# Altium project bdcmc-26.PrjPcb (part 1 of 2)
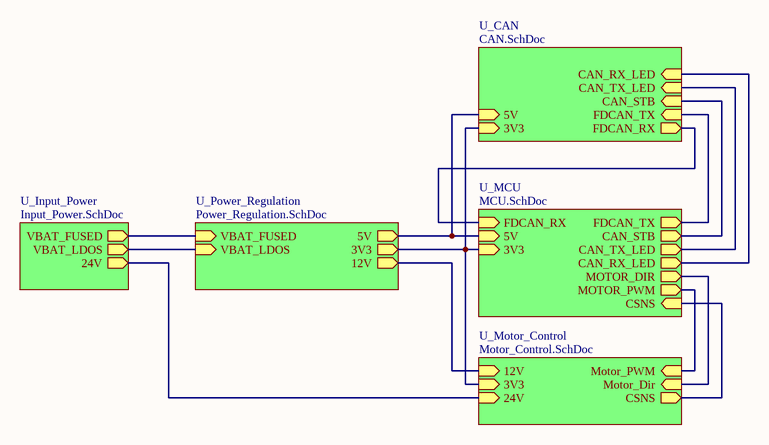
[diagram p0: TLD.SchDoc]
6 sheets, 206 parts. Net scope: hierarchical (ports join the sheet entries above them; power ports are global).
Board file: bdcmc.PcbDoc
Sheets:
  TLD.SchDoc
    U_CAN = CAN.SchDoc
    U_Input_Power = Input_Power.SchDoc
    U_MCU = MCU.SchDoc
    U_Motor_Control = Motor_Control.SchDoc
    U_Power_Regulation = Power_Regulation.SchDoc

## Sheet TLD.SchDoc
size A; SheetNumber: 1; SheetTotal: 6

### Sub-sheets
U_CAN = CAN.SchDoc: FDCAN_RX (out), FDCAN_TX (in), CAN_TX_LED (in), CAN_RX_LED (in), CAN_STB (in), 5V (in), 3V3 (in)
U_Input_Power = Input_Power.SchDoc: VBAT_FUSED (out), VBAT_LDOS (out), 24V (out)
U_MCU = MCU.SchDoc: MOTOR_PWM (out), MOTOR_DIR (out), CAN_TX_LED (out), CAN_RX_LED (out), FDCAN_TX (out), FDCAN_RX (in), 5V (in), 3V3 (in), CAN_STB (out), CSNS (in)
U_Motor_Control = Motor_Control.SchDoc: Motor_PWM (in), Motor_Dir (in), 12V (in), 3V3 (in), CSNS (out), 24V (in)
U_Power_Regulation = Power_Regulation.SchDoc: 5V (out), 3V3 (out), 12V (out), VBAT_FUSED (in), VBAT_LDOS (in)

### Nets
3V3: sheet U_CAN/3V3, sheet U_MCU/3V3, sheet U_Motor_Control/3V3, sheet U_Power_Regulation/3V3
5V: sheet U_CAN/5V, sheet U_MCU/5V, sheet U_Power_Regulation/5V
12V: sheet U_Motor_Control/12V, sheet U_Power_Regulation/12V
24V: sheet U_Input_Power/24V, sheet U_Motor_Control/24V
VBAT_FUSED: sheet U_Input_Power/VBAT_FUSED, sheet U_Power_Regulation/VBAT_FUSED
VBAT_LDOS: sheet U_Input_Power/VBAT_LDOS, sheet U_Power_Regulation/VBAT_LDOS
CAN_RX_LED: sheet U_CAN/CAN_RX_LED, sheet U_MCU/CAN_RX_LED
CAN_STB: sheet U_CAN/CAN_STB, sheet U_MCU/CAN_STB
CAN_TX_LED: sheet U_CAN/CAN_TX_LED, sheet U_MCU/CAN_TX_LED
CSNS: sheet U_MCU/CSNS, sheet U_Motor_Control/CSNS
FDCAN_RX: sheet U_CAN/FDCAN_RX, sheet U_MCU/FDCAN_RX
FDCAN_TX: sheet U_CAN/FDCAN_TX, sheet U_MCU/FDCAN_TX
MOTOR_DIR: sheet U_MCU/MOTOR_DIR, sheet U_Motor_Control/Motor_Dir
MOTOR_PWM: sheet U_MCU/MOTOR_PWM, sheet U_Motor_Control/Motor_PWM

## Sheet CAN.SchDoc
size A; SheetNumber: 2; SheetTotal: 6
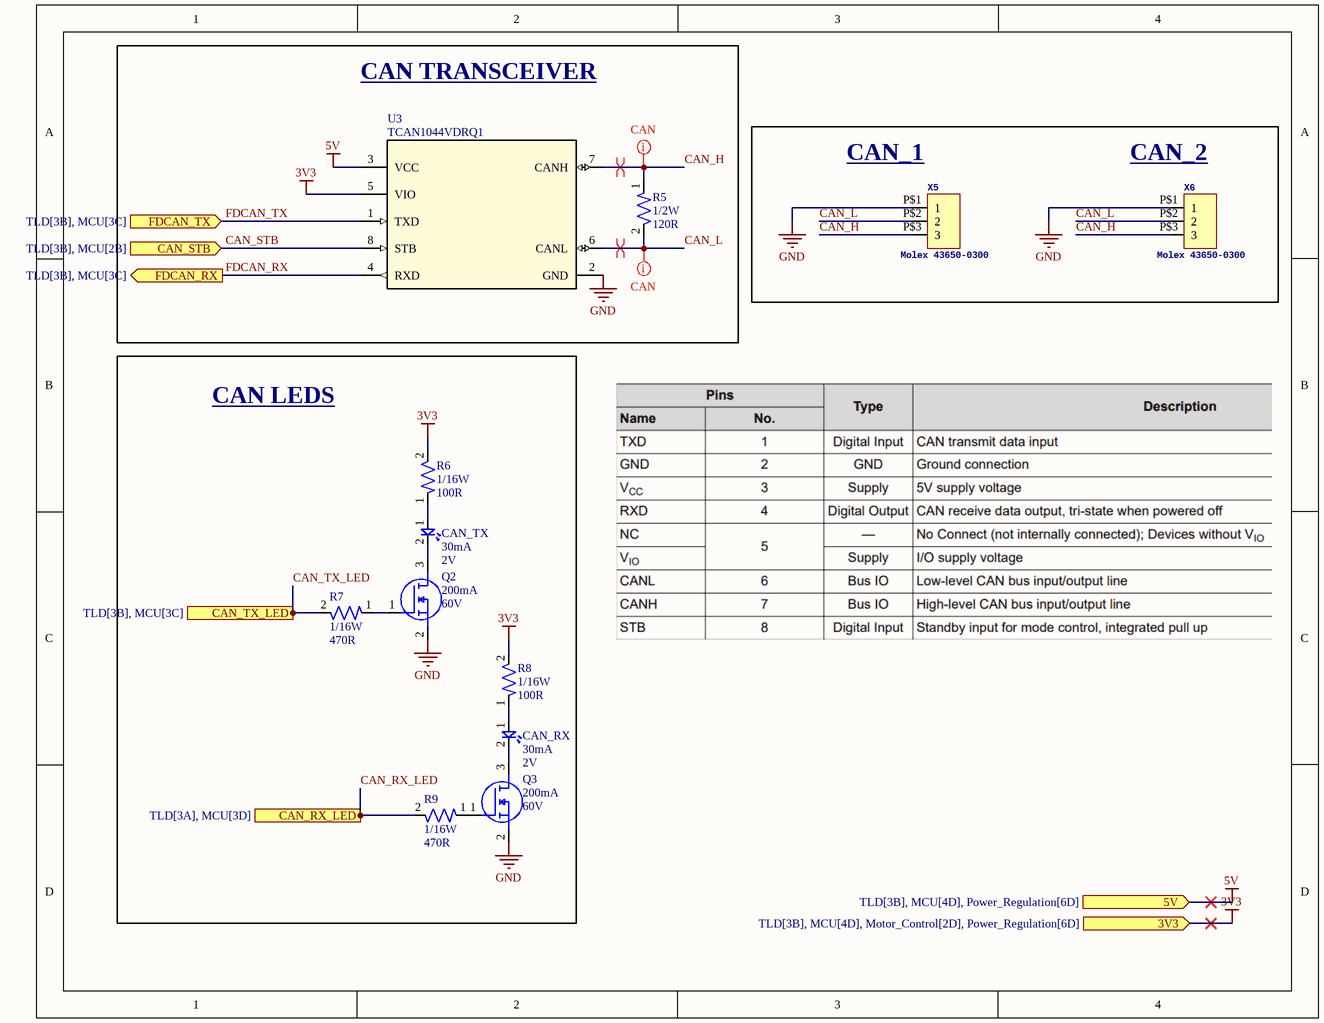
[diagram p1: CAN.SchDoc]

### Parts
CAN_RX  Forward Current: 30mA  Forward Voltage: 2V  [LED-0603]  (hidden comment: BL-HKC36G-AV-TRB)
CAN_TX  Forward Current: 30mA  Forward Voltage: 2V  [LED-0603]  (hidden comment: BL-HKC36G-AV-TRB)
Q2  Continuous Current: 200mA  Voltage: 60V  [IC-SOT23-3]  (hidden comment: T2N7002AK,LM)
Q3  Continuous Current: 200mA  Voltage: 60V  [IC-SOT23-3]  (hidden comment: T2N7002AK,LM)
R5  Power: 1/2W  Resistance: 120R  [RES-1210]  (hidden comment: RC1210FR-07120RL)
R6  Power: 1/16W  Resistance: 100R  [RES-0402]  (hidden comment: RC0402FR-07100RL)
R7  Power: 1/16W  Resistance: 470R  [RES-0402]  (hidden comment: RC0402FR-07470RL)
R8  Power: 1/16W  Resistance: 100R  [RES-0402]  (hidden comment: RC0402FR-07100RL)
R9  Power: 1/16W  Resistance: 470R  [RES-0402]  (hidden comment: RC0402FR-07470RL)
U3  TCAN1044VDRQ1  [IC-8SOIC]
X5  Molex 43650-0300  [43650-0300]
X6  Molex 43650-0300  [43650-0300]

### Blocks framed on the sheet
CAN TRANSCEIVER: R5 U3
CAN LEDS: CAN_RX CAN_TX Q2 Q3 R6-R9

### Ports
3V3 (in, see TLD[3B], MCU[4D], Motor_Control[2D], Power_Regulation[6D]), 5V (in, see TLD[3B], MCU[4D], Power_Regulation[6D]), CAN_RX_LED (in, see TLD[3A], MCU[3D]), CAN_STB (in, see TLD[3B], MCU[2B]), CAN_TX_LED (in, see TLD[3B], MCU[3C]), FDCAN_RX (out, see TLD[3B], MCU[3C]), FDCAN_TX (in, see TLD[3B], MCU[3C])

### Nets
3V3: R6.2 R8.2 U3.5(VIO) ; port 3V3
5V: U3.3(VCC) ; port 5V
GND: Q2.2(S) Q3.2(S) U3.2(GND) X5.P$1(1) X6.P$1(1)
CAN_H: R5.1 U3.7(CANH) X5.P$3(3) X6.P$3(3)
CAN_L: R5.2 U3.6(CANL) X5.P$2(2) X6.P$2(2)
CAN_RX_LED: R9.2 ; port CAN_RX_LED
CAN_STB: U3.8(STB) ; port CAN_STB
CAN_TX_LED: R7.2 ; port CAN_TX_LED
FDCAN_RX: U3.4(RXD) ; port FDCAN_RX
FDCAN_TX: U3.1(TXD) ; port FDCAN_TX
NetCAN_RX_1: CAN_RX.1 R8.1
NetCAN_RX_2: CAN_RX.2 Q3.3(D)
NetCAN_TX_1: CAN_TX.1 R6.1
NetCAN_TX_2: CAN_TX.2 Q2.3(D)
NetQ2_1: Q2.1(G) R7.1
NetQ3_1: Q3.1(G) R9.1

### Layout directives
differential pair; differential pair class CAN: CAN_H, CAN_L
mark named CAN: CAN_H, CAN_L

### Notes on the sheet
- (near X5) CAN_1
- (near X6) CAN_2

### Library data of the parts
CAN_RX CAN_TX = LED-0001: LED YELLOW CLEAR 0603 SMD; ComponentLink1Description: Datasheet; ComponentLink1URL: https://www.americanbrightled.com/pdffiles/led-components/smt/BL-HKC36G-AV-TRB.pdf
Q2 Q3 = NMOS-200MA-0001: MOSFET N-CH 60V 200MA SOT23; ComponentLink1Description: Datasheet; ComponentLink1URL: https://toshiba.semicon-storage.com/info/T2N7002AK_datasheet_en_20150401.pdf?did=29712&prodName=T2N7002AK
R5 = RES-120-0001: RES 120 OHM 1% 1/2W 1210; Tolerance: 1%; Size: 1210; ComponentLink1Description: Datasheet; ComponentLink1URL: https://www.yageo.com/upload/media/product/products/datasheet/rchip/PYu-RC_Group_51_RoHS_L_12.pdf
R6 R8 = RES-100-0001: RES 100 OHM 1% 1/16W 0402; Tolerance: 1%; Size: 0402; ComponentLink1Description: Datasheet; ComponentLink1URL: https://www.yageo.com/upload/media/product/products/datasheet/rchip/PYu-RC_Group_51_RoHS_L_12.pdf
R7 R9 = RES-470-0001: RES 470 OHM 1% 1/16W 0402; Tolerance: 1%; Size: 0402; ComponentLink1Description: Datasheet; ComponentLink1URL: https://www.yageo.com/upload/media/product/products/datasheet/rchip/PYu-RC_Group_51_RoHS_L_12.pdf
U3 = IC-CAN-0001: IC TRANSCEIVER 1/1 8SOIC; ComponentLink1Description: Datasheet; ComponentLink1URL: https://www.ti.com/lit/ds/symlink/tcan1044-q1.pdf?HQS=dis-dk-null-digikeymode-dsf-pf-null-wwe&ts=1728758303289&ref_url=https%253A%252F%252Fwww.ti.com%252Fgeneral%252Fdocs%252Fsuppproductinfo.tsp%253FdistId%253D10%2526gotoUrl%253Dhttps%253A%252F%252Fwww.ti.com%252Flit%252Fgpn%252Ftcan1044-q1
X5 X6 = Micro-Fit Molex 3 Pin Right Angle: GateName_1: G$1; SymbolName_1: HEADER_POS3; DeviceSetName: HEADER_POS3_?; DeviceName: 43650-0300; LibraryName: con-molex-micro-fit-3_0_2; Package: 43650-0300

## Sheet Input_Power.SchDoc
size A; SheetNumber: 5; SheetTotal: 6
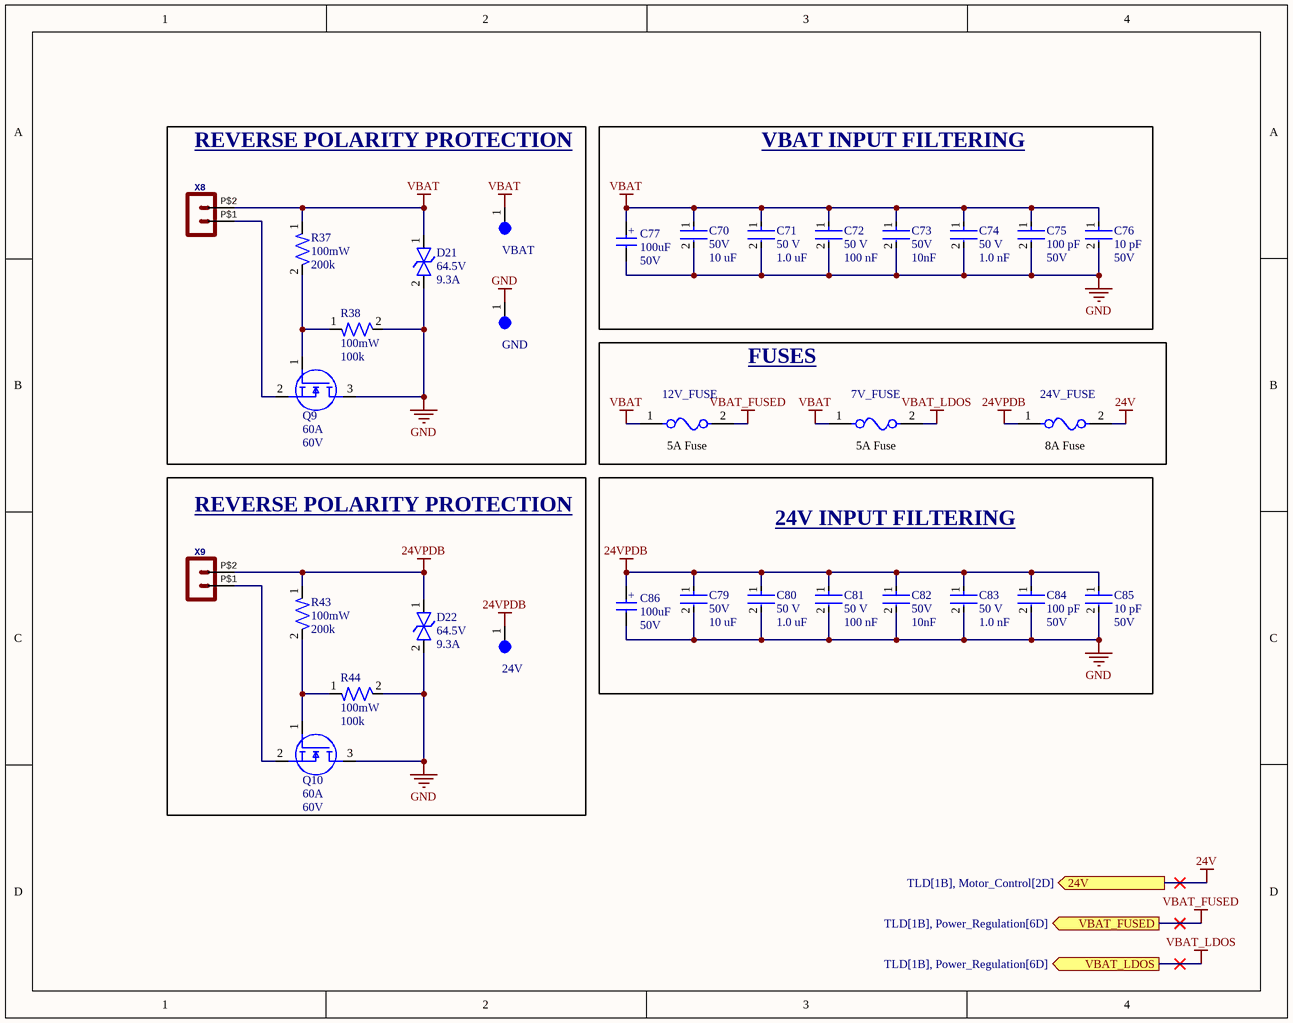
[diagram p2: Input_Power.SchDoc]

### Parts
7V_FUSE  01550900M  [FUSE-0001]  (value not drawn)
12V_FUSE  01550900M  [FUSE-0001]  (value not drawn)
24V  5003  [TEST-POINT-0001]  (value not drawn)
24V_FUSE  01550900M  [FUSE-0001]  (value not drawn)
C70  Voltage: 50V  Capacitance: 10 uF  [CAP-1210]  (hidden comment: CL32B106KBJNNNE)
C71  Voltage: 50 V  Capacitance: 1.0 uF  [CAP-0805]  (hidden comment: CC0805KKX7R9BB105)
C72  Voltage Rating: 50 V  Capacitance: 100 nF  [CAP-0805]  (hidden comment: CC0805KRX7R9BB104)
C73  Voltage: 50V  Capacitance: 10nF  [CAP-0805]  (hidden comment: GRM2195C1H103JA01D)
C74  Voltage: 50 V  Capacitance: 1.0 nF  [CAP-0402]  (hidden comment: CC0402KRX7R9BB102)
C75  Capacitance: 100 pF  Voltage: 50V  [CAP-0402]  (hidden comment: CC0402JRNPO9BN101)
C76  Capacitance: 10 pF  Voltage: 50V  [CAP-0402]  (hidden comment: CC0402JRNPO9BN100)
C77  Capacitance: 100uF  Voltage: 50V  [WCAP-ATUL_8X11.5(DXL)]  (hidden comment: 860040674004)
C79  Voltage: 50V  Capacitance: 10 uF  [CAP-1210]  (hidden comment: CL32B106KBJNNNE)
C80  Voltage: 50 V  Capacitance: 1.0 uF  [CAP-0805]  (hidden comment: CC0805KKX7R9BB105)
C81  Voltage Rating: 50 V  Capacitance: 100 nF  [CAP-0805]  (hidden comment: CC0805KRX7R9BB104)
C82  Voltage: 50V  Capacitance: 10nF  [CAP-0805]  (hidden comment: GRM2195C1H103JA01D)
C83  Voltage: 50 V  Capacitance: 1.0 nF  [CAP-0402]  (hidden comment: CC0402KRX7R9BB102)
C84  Capacitance: 100 pF  Voltage: 50V  [CAP-0402]  (hidden comment: CC0402JRNPO9BN101)
C85  Capacitance: 10 pF  Voltage: 50V  [CAP-0402]  (hidden comment: CC0402JRNPO9BN100)
C86  Capacitance: 100uF  Voltage: 50V  [WCAP-ATUL_8X11.5(DXL)]  (hidden comment: 860040674004)
D21  Voltage Rating: 64.5V  Current Rating: 9.3A  [DO-214AA (SMBJ)]  (hidden comment: SMBJ40CA)
D22  Voltage Rating: 64.5V  Current Rating: 9.3A  [DO-214AA (SMBJ)]  (hidden comment: SMBJ40CA)
GND  5003  [TEST-POINT-0001]  (value not drawn)
Q9  Voltage: 60V  Continuous Current: 60A  [IC-8VSONCLIP]  (hidden comment: CSD18543Q3AT)
Q10  Voltage: 60V  Continuous Current: 60A  [IC-8VSONCLIP]  (hidden comment: CSD18543Q3AT)
R37  Power: 100mW  Resistance: 200k  [RES-0603]  (hidden comment: RC0603FR-07200KL)
R38  Power: 100mW  Resistance: 100k  [RES-0603]  (hidden comment: RC0603FR-07100KL)
R43  Power: 100mW  Resistance: 200k  [RES-0603]  (hidden comment: RC0603FR-07200KL)
R44  Power: 100mW  Resistance: 100k  [RES-0603]  (hidden comment: RC0603FR-07100KL)
VBAT  5003  [TEST-POINT-0001]  (value not drawn)
X8  Molex - Micro-Fit 3.0 Series connector,  3.00mm (0.118") pitch header, 2 positions.  [43045-0200]  (value not drawn)
X9  Molex - Micro-Fit 3.0 Series connector,  3.00mm (0.118") pitch header, 2 positions.  [43045-0200]  (value not drawn)

### Blocks framed on the sheet
REVERSE POLARITY PROTECTION: D21 GND Q9 R37 R38 VBAT X8
VBAT INPUT FILTERING: C70-C77
FUSES: 7V_FUSE 12V_FUSE 24V_FUSE
REVERSE POLARITY PROTECTION: 24V D22 Q10 R43 R44 X9
24V INPUT FILTERING: C79-C86

### Ports
24V (out, see TLD[1B], Motor_Control[2D]), VBAT_FUSED (out, see TLD[1B], Power_Regulation[6D]), VBAT_LDOS (out, see TLD[1B], Power_Regulation[6D])

### Nets
24V: 24V_FUSE.2 ; port 24V
24VPDB: 24V.1 24V_FUSE.1 C79.1 C80.1 C81.1 C82.1 C83.1 C84.1 C85.1 C86.1(POS) D22.1 R43.1 X9.P$2
GND: C70.2 C71.2 C72.2 C73.2 C74.2 C75.2 C76.2 C77.2(NEG) C79.2 C80.2 C81.2 C82.2 C83.2 C84.2 C85.2 C86.2(NEG) D21.2 D22.2 GND.1 Q9.3(D) Q10.3(D) R38.2 R44.2
VBAT: 7V_FUSE.1 12V_FUSE.1 C70.1 C71.1 C72.1 C73.1 C74.1 C75.1 C76.1 C77.1(POS) D21.1 R37.1 VBAT.1 X8.P$2
VBAT_FUSED: 12V_FUSE.2 ; port VBAT_FUSED
VBAT_LDOS: 7V_FUSE.2 ; port VBAT_LDOS
NetQ9_1: Q9.1(G) R37.2 R38.1
NetQ9_2: Q9.2(S) X8.P$1
NetQ10_1: Q10.1(G) R43.2 R44.1
NetQ10_2: Q10.2(S) X9.P$1

### Notes on the sheet
- (near 12V_FUSE) 5A Fuse
- (near 7V_FUSE) 5A Fuse
- (near 24V_FUSE) 8A Fuse
- (in symbol CAP-100u-0001) +

### Library data of the parts
7V_FUSE 12V_FUSE 24V_FUSE = FUSE-0001: FUSE BLOK CARTRIDGE 125V 10A SMD; Fuse Current: 8A; ComponentLink2Description: Datasheet; ComponentLink2URL: https://www.littelfuse.com/~/media/electronics/datasheets/fuses/littelfuse_fuse_154_154t_154l_154tl_datasheet.pdf.pdf; Voltage Rating: 125V
24V GND VBAT = TEST-POINT-0001: Oranange PC Test Point, Miniature Phoisphor Bronze Silver Plating Through Hole Mounting Type
C70 C79 = CAP-10U-0002: CAP CER 10UF 50V X7R 1210; Device Class: Ceramic; Size: 1210; ComponentLink1Description: Datasheet; ComponentLink1URL: https://mm.digikey.com/Volume0/opasdata/d220001/medias/docus/41/CL32B106KBJNNNE_Spec.pdf
C71 C80 = CAP-1U-0001: CAP CER 1UF 50V X7R 0805; ComponentLink2URL: https://www.yageo.com/upload/media/product/productsearch/datasheet/mlcc/UPY-GPHC_X7R_6.3V-to-250V_24.pdf; ComponentLink2Description: Datasheet; Device Class: Ceramic; Size: 0805
C72 C81 = CAP-0.1U-0002: CAP CER 0.1UF 50V X7R 0805; ComponentLink2Description: Datasheet; ComponentLink2URL: https://www.yageo.com/upload/media/product/productsearch/datasheet/mlcc/UPY-GPHC_X7R_6.3V-to-250V_24.pdf; Device Class: Ceramic; Size: 0805
C73 C82 = CAP-10N-0001: CAP CER 10000PF 50V C0G/NP0 0805; Device Class: Ceramic; Size: 0805; ComponentLink1Description: Datasheet; ComponentLink1URL: https://search.murata.co.jp/Ceramy/image/img/A01X/G101/ENG/GRM2195C1H103JA01-01.pdf
C74 C83 = CAP-1N-0001: CAP CER 1000PF 50V X7R 0402; ComponentLink2Description: Datasheet; ComponentLink2URL: http://www.yageo.com/documents/recent/UPY-GP_NP0_16V-to-50V_16.pdf; Device Class: Ceramic; Size: 0402
C75 C84 = CAP-100P-0001: CAP CER 100PF 50V C0G/NPO 0402; Device Class: Ceramic; Size: 0402; ComponentLink1Description: Datasheet; ComponentLink1URL: https://www.yageo.com/upload/media/product/productsearch/datasheet/mlcc/UPY-GP_NP0_16V-to-50V_18.pdf
C76 C85 = CAP-10P-0001: CAP CER 10PF 50V C0G/NPO 0402; Device Class: Ceramic; Size: 0402; ComponentLink1Description: Datasheet; ComponentLink1URL: https://www.yageo.com/upload/media/product/productsearch/datasheet/mlcc/UPY-GP_NP0_16V-to-50V_18.pdf
C77 C86 = CAP-100u-0001: 100 µF 50 V Aluminum Electrolytic Capacitors Radial, Can 7000 Hrs @ 105°C; MF: {'manufacturer': u'W\xfcrth Elektronik'}; Package: None; Price: None; MP: 860040674004; Availability: Unavailable; ComponentLink1Description: Datasheet; ComponentLink1URL: https://www.we-online.com/components/products/datasheet/860040674004.pdf
D21 D22 = DIO-TVS-0001: TVS DIODE 40VWM 64.5VC DO214AA; ComponentLink1Description: Datasheet; ComponentLink1URL: https://www.littelfuse.com/media?resourcetype=datasheets&itemid=09a6ae9a-73cb-4ac4-acac-e6dab92ab953&filename=littelfuse_tvs_diode_smbj_datasheet.pdf
Q9 Q10 = NMOS-60A-0001: MOSFET N-CH 60V 12A/60A 8VSON; ComponentLink2Description: Datasheet; ComponentLink2URL: http://www.ti.com/lit/ds/symlink/csd18543q3a.pdf
R37 R43 = RES-200k-0001: RES SMD 200K OHM 1% 1/10W 0603; Tolerance: 1%; Size: 0603; ComponentLink1Description: Datasheet; ComponentLink1URL: https://www.yageo.com/upload/media/product/products/datasheet/rchip/PYu-RC_Group_51_RoHS_L_12.pdf
R38 R44 = RES-100k-0001: RES SMD 100K OHM 1% 1/10W 0603; Tolerance: 1%; Size: 0603; ComponentLink1Description: Datasheet; ComponentLink1URL: https://www.yageo.com/upload/media/product/products/datasheet/rchip/PYu-RC_Group_51_RoHS_L_12.pdf
X8 X9 = HEADER_POS2_43045-0200: GateName_1: G$1; DeviceSetName: HEADER_POS2_?; SymbolName_1: HEADER_POS2; DeviceName: 43045-0200; LibraryName: con-molex-micro-fit-3_0_2; Package: 43045-0200

## Sheet MCU.SchDoc
size A; SheetNumber: 6; SheetTotal: 6
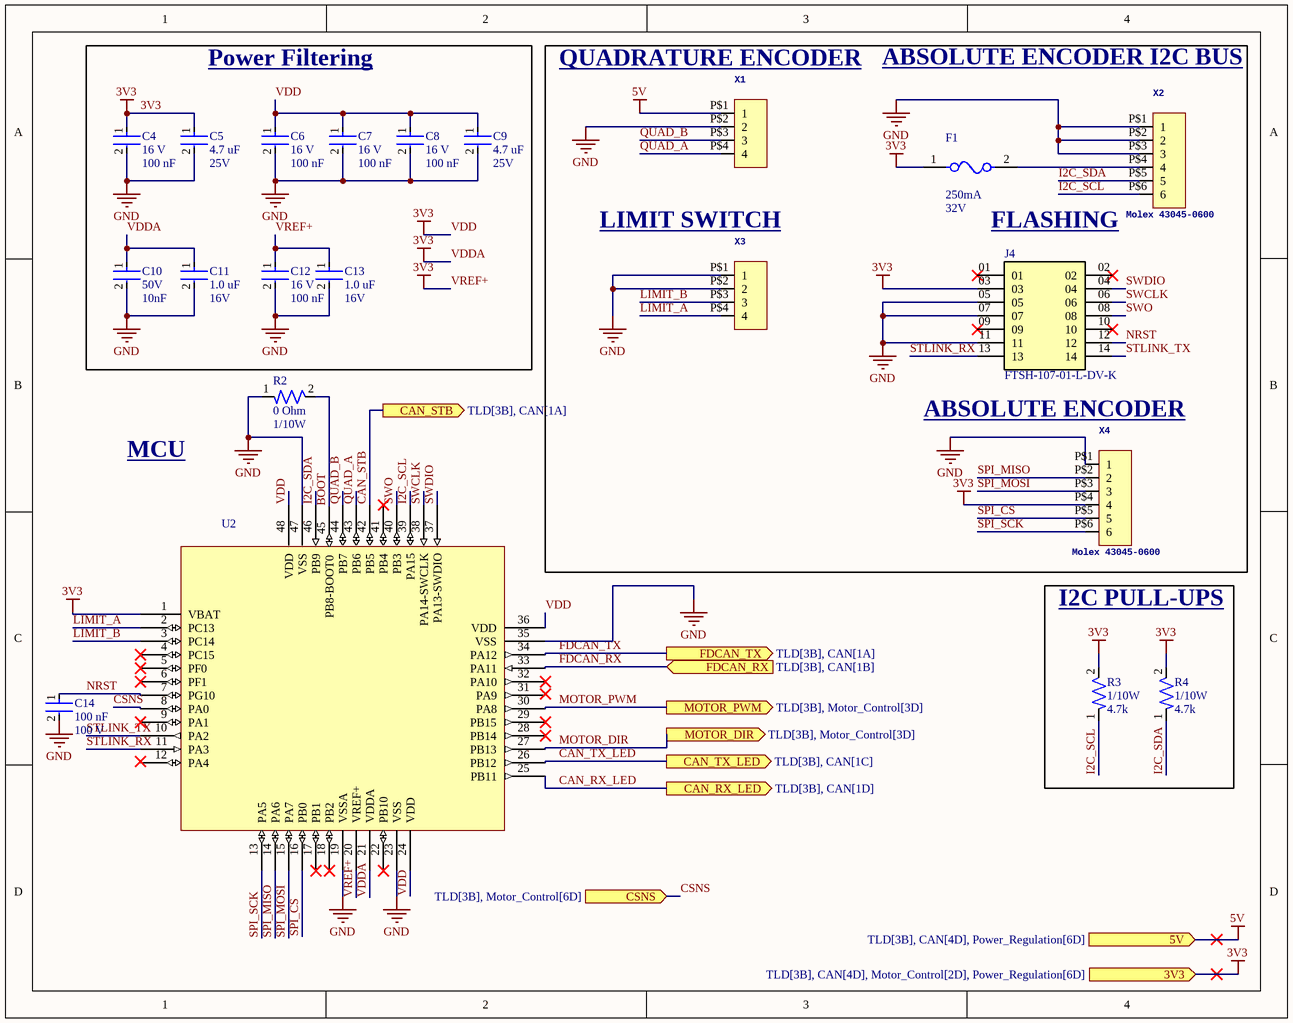
[diagram p3: MCU.SchDoc]

### Parts
C4  Voltage Rating: 16 V  Capacitance: 100 nF  [CAP-0402]  (hidden comment: CC0402KRX7R7BB104)
C5  Capacitance: 4.7 uF  Voltage: 25V  [CAP-0603]  (hidden comment: CC0603KRX5R8BB475)
C6  Voltage Rating: 16 V  Capacitance: 100 nF  [CAP-0402]  (hidden comment: CC0402KRX7R7BB104)
C7  Voltage Rating: 16 V  Capacitance: 100 nF  [CAP-0402]  (hidden comment: CC0402KRX7R7BB104)
C8  Voltage Rating: 16 V  Capacitance: 100 nF  [CAP-0402]  (hidden comment: CC0402KRX7R7BB104)
C9  Capacitance: 4.7 uF  Voltage: 25V  [CAP-0603]  (hidden comment: CC0603KRX5R8BB475)
C10  Voltage: 50V  Capacitance: 10nF  [CAP-0805]  (hidden comment: GRM2195C1H103JA01D)
C11  Capacitance: 1.0 uF  Voltage: 16V  [CAP-0603]  (hidden comment: CC0603KRX7R7BB105)
C12  Voltage Rating: 16 V  Capacitance: 100 nF  [CAP-0402]  (hidden comment: CC0402KRX7R7BB104)
C13  Capacitance: 1.0 uF  Voltage: 16V  [CAP-0603]  (hidden comment: CC0603KRX7R7BB105)
C14  Capacitance: 100 nF  Voltage: 100 V  [CAP-0603]  (hidden comment: CC0603KRX7R0BB104)
F1  Fuse Current: 250mA  Voltage Rating: 32V  [RES-0603]  (hidden comment: 0467.250NRHF)
J4  FTSH-107-01-L-DV-K  [SAMTEC_FTSH-107-01-L-DV-K]
R2  Resistance: 0 Ohm  Power: 1/10W  [RESC1607X60N]  (hidden comment: RESC1607X60N)
R3  Power: 1/10W  Resistance: 4.7k  [RES-0603]  (hidden comment: RC0603FR-074K7L)
R4  Power: 1/10W  Resistance: 4.7k  [RES-0603]  (hidden comment: RC0603FR-074K7L)
U2  STM32G431CBT6  [IC-LQFP48]  (value not drawn)
X1  Molex - Micro-Fit 3.0 Series connector,  3.00mm (0.118") pitch header, 4 positions.  [43045-0400]  (value not drawn)
X2  Molex 43045-0600  [43045-0600]
X3  Molex - Micro-Fit 3.0 Series connector,  3.00mm (0.118") pitch header, 4 positions.  [43045-0400]  (value not drawn)
X4  Molex 43045-0600  [43045-0600]

### Blocks framed on the sheet
Power Filtering: C4-C13
I2C PULL-UPS: R3 R4

### Ports
3V3 (in, see TLD[3B], CAN[4D], Motor_Control[2D], Power_Regulation[6D]), 5V (in, see TLD[3B], CAN[4D], Power_Regulation[6D]), CAN_RX_LED (out, see TLD[3B], CAN[1D]), CAN_STB (out, see TLD[3B], CAN[1A]), CAN_TX_LED (out, see TLD[3B], CAN[1C]), CSNS (in, see TLD[3B], Motor_Control[6D]), FDCAN_RX (in, see TLD[3B], CAN[1B]), FDCAN_TX (out, see TLD[3B], CAN[1A]), MOTOR_DIR (out, see TLD[3B], Motor_Control[3D]), MOTOR_PWM (out, see TLD[3B], Motor_Control[3D])

### Nets
3V3: C4.1 C5.1 C6.1 C7.1 C8.1 C9.1 C10.1 C11.1 C12.1 C13.1 F1.1 J4.03 R3.2 R4.2 U2.1(VBAT) U2.20(VREF+) U2.21(VDDA) U2.24(VDD) U2.36(VDD) U2.48(VDD) X4.P$4(4) ; port 3V3  [also labelled VDD, VDDA, VREF+]
5V: X1.P$1(1) ; port 5V
GND: C4.2 C5.2 C6.2 C7.2 C8.2 C9.2 C10.2 C11.2 C12.2 C13.2 C14.2 J4.05 J4.07 J4.11 R2.1 U2.19(VSSA) U2.23(VSS) U2.35(VSS) U2.47(VSS) X1.P$2(2) X2.P$1(1) X2.P$2(2) X2.P$3(3) X3.P$1(1) X3.P$2(2) X4.P$1(1)
BOOT: R2.2 U2.45(PB8-BOOT0)
CAN_RX_LED: U2.25(PB11) ; port CAN_RX_LED
CAN_STB: U2.42(PB5) ; port CAN_STB
CAN_TX_LED: U2.26(PB12) ; port CAN_TX_LED
CSNS: U2.8(PA0) ; port CSNS
FDCAN_RX: U2.33(PA11) ; port FDCAN_RX
FDCAN_TX: U2.34(PA12) ; port FDCAN_TX
I2C_SCL: R3.1 U2.39(PA15) X2.P$6(6)
I2C_SDA: R4.1 U2.46(PB9) X2.P$5(5)
LIMIT_A: U2.2(PC13) X3.P$4(4)
LIMIT_B: U2.3(PC14) X3.P$3(3)
MOTOR_DIR: U2.27(PB13) ; port MOTOR_DIR
MOTOR_PWM: U2.30(PA8) ; port MOTOR_PWM
NRST: C14.1 J4.12 U2.7(PG10)
QUAD_A: U2.43(PB6) X1.P$4(4)
QUAD_B: U2.44(PB7) X1.P$3(3)
SPI_CS: U2.16(PB0) X4.P$5(5)
SPI_MISO: U2.14(PA6) X4.P$2(2)
SPI_MOSI: U2.15(PA7) X4.P$3(3)
SPI_SCK: U2.13(PA5) X4.P$6(6)
STLINK_RX: J4.13 U2.11(PA3)
STLINK_TX: J4.14 U2.10(PA2)
SWCLK: J4.06 U2.38(PA14-SWCLK)
SWDIO: J4.04 U2.37(PA13-SWDIO)
SWO: J4.08 U2.40(PB3)
NetF1_2: F1.2 X2.P$4(4)

Not connected (* = marked no-connect by the designer): J4 01* 02* 09* 10*; U2 4(PC15)* 5(PF0)* 6(PF1)* 9(PA1)* 12(PA4) 17(PB1)* 18(PB2)* 22(PB10)* 28(PB14)* 29(PB15)* 31(PA9) 32(PA10)* 41(PB4)*

### Notes on the sheet
- (near X1) QUADRATURE ENCODER
- ABSOLUTE ENCODER I2C BUS
- LIMIT SWITCH
- FLASHING
- ABSOLUTE ENCODER
- MCU

### Library data of the parts
C4 C6-C8 C12 = CAP-0.1U-0001: CAP CER 0.1UF 16V X7R 0402; ComponentLink2Description: Datasheet; ComponentLink2URL: https://www.yageo.com/upload/media/product/productsearch/datasheet/mlcc/UPY-GPHC_X7R_6.3V-to-250V_24.pdf; Device Class: Ceramic; Size: 0402
C5 C9 = CAP-4.7U-0001: CAP CER 4.7UF 25V X5R 0603; Device Class: Ceramic; Size: 0603
C10 = CAP-10N-0001: CAP CER 10000PF 50V C0G/NP0 0805; Device Class: Ceramic; Size: 0805; ComponentLink1Description: Datasheet; ComponentLink1URL: https://search.murata.co.jp/Ceramy/image/img/A01X/G101/ENG/GRM2195C1H103JA01-01.pdf
C11 C13 = CAP-1U-0002: CAP CER 1UF 16V X7R 0603; Device Class: Ceramic; Size: 0603
C14 = CAP-100N-0001: CAP CER 0.1UF 100V X7R 0603; Device Class: Ceramic; Size: 0603; ComponentLink1Description: Datasheet; ComponentLink1URL: https://www.yageo.com/upload/media/product/app/datasheet/mlcc/upy-np0x7r_mv_100-to-630v.pdf
F1 = FUSE-0002: FUSE BRD MT 250MA 32VAC 32VDC; ComponentLink2Description: Datasheet; ComponentLink2URL: https://www.littelfuse.com/media?resourcetype=datasheets&itemid=4a59f034-1cca-460e-a5ba-e1e66247c76d&filename=littelfuse_fuse_467_datasheet.pdf
J4 = CONN_Flashing-0001: Connector Header Surface Mount 14 position 0.050" (1.27mm); MF: Samtec; Value: *; Price: None; Package: None; Availability: Unavailable; MP: FTSH-107-01-L-DV-K; ComponentLink1Description: Datasheet; ComponentLink1URL: https://mm.digikey.com/Volume0/opasdata/d220001/medias/docus/6209/ftsh-1xx-xx-xxx-dv-xxx-xxx-x-xx-mkt.pdf
R2 = RES-0-0003: 0 Ohms Jumper Chip Resistor 0603 (1608 Metric) Moisture Resistant Thick Film; assembled?: yes; JLC part number: C106231
R3 R4 = RES-4.7k-0001: RES 4.7K OHM 1% 1/10W 0603; Tolerance: 1%; Size: 0603; ComponentLink1Description: Datasheet; ComponentLink1URL: https://www.yageo.com/upload/media/product/products/datasheet/rchip/PYu-RC_Group_51_RoHS_L_12.pdf
U2 = IC-STM32G431CBT6: IC MCU 32BIT 128KB FLASH 48LQFP; Package: 48LQFP; ComponentLink1Description: Datasheet; ComponentLink1URL: https://www.st.com/resource/en/datasheet/stm32g431cb.pdf
X1 X3 = HEADER_POS4_?43045-0401: GateName_1: G$1; SymbolName_1: HEADER_POS4; DeviceName: 43045-0401; LibraryName: con-molex-micro-fit-3_0_2; DeviceSetName: HEADER_POS4_?; Package: 43045-0400
X2 X4 = Micro-Fit Molex 6 Pin 2 Row Right Angle: GateName_1: G$1; SymbolName_1: HEADER_POS6; DeviceSetName: HEADER_POS6_?; DeviceName: 43045-0600; LibraryName: con-molex-micro-fit-3_0_2; Package: 43045-0600

## Sheet Motor_Control.SchDoc
size 304 x 241 mm; SheetNumber: 3; SheetTotal: 6
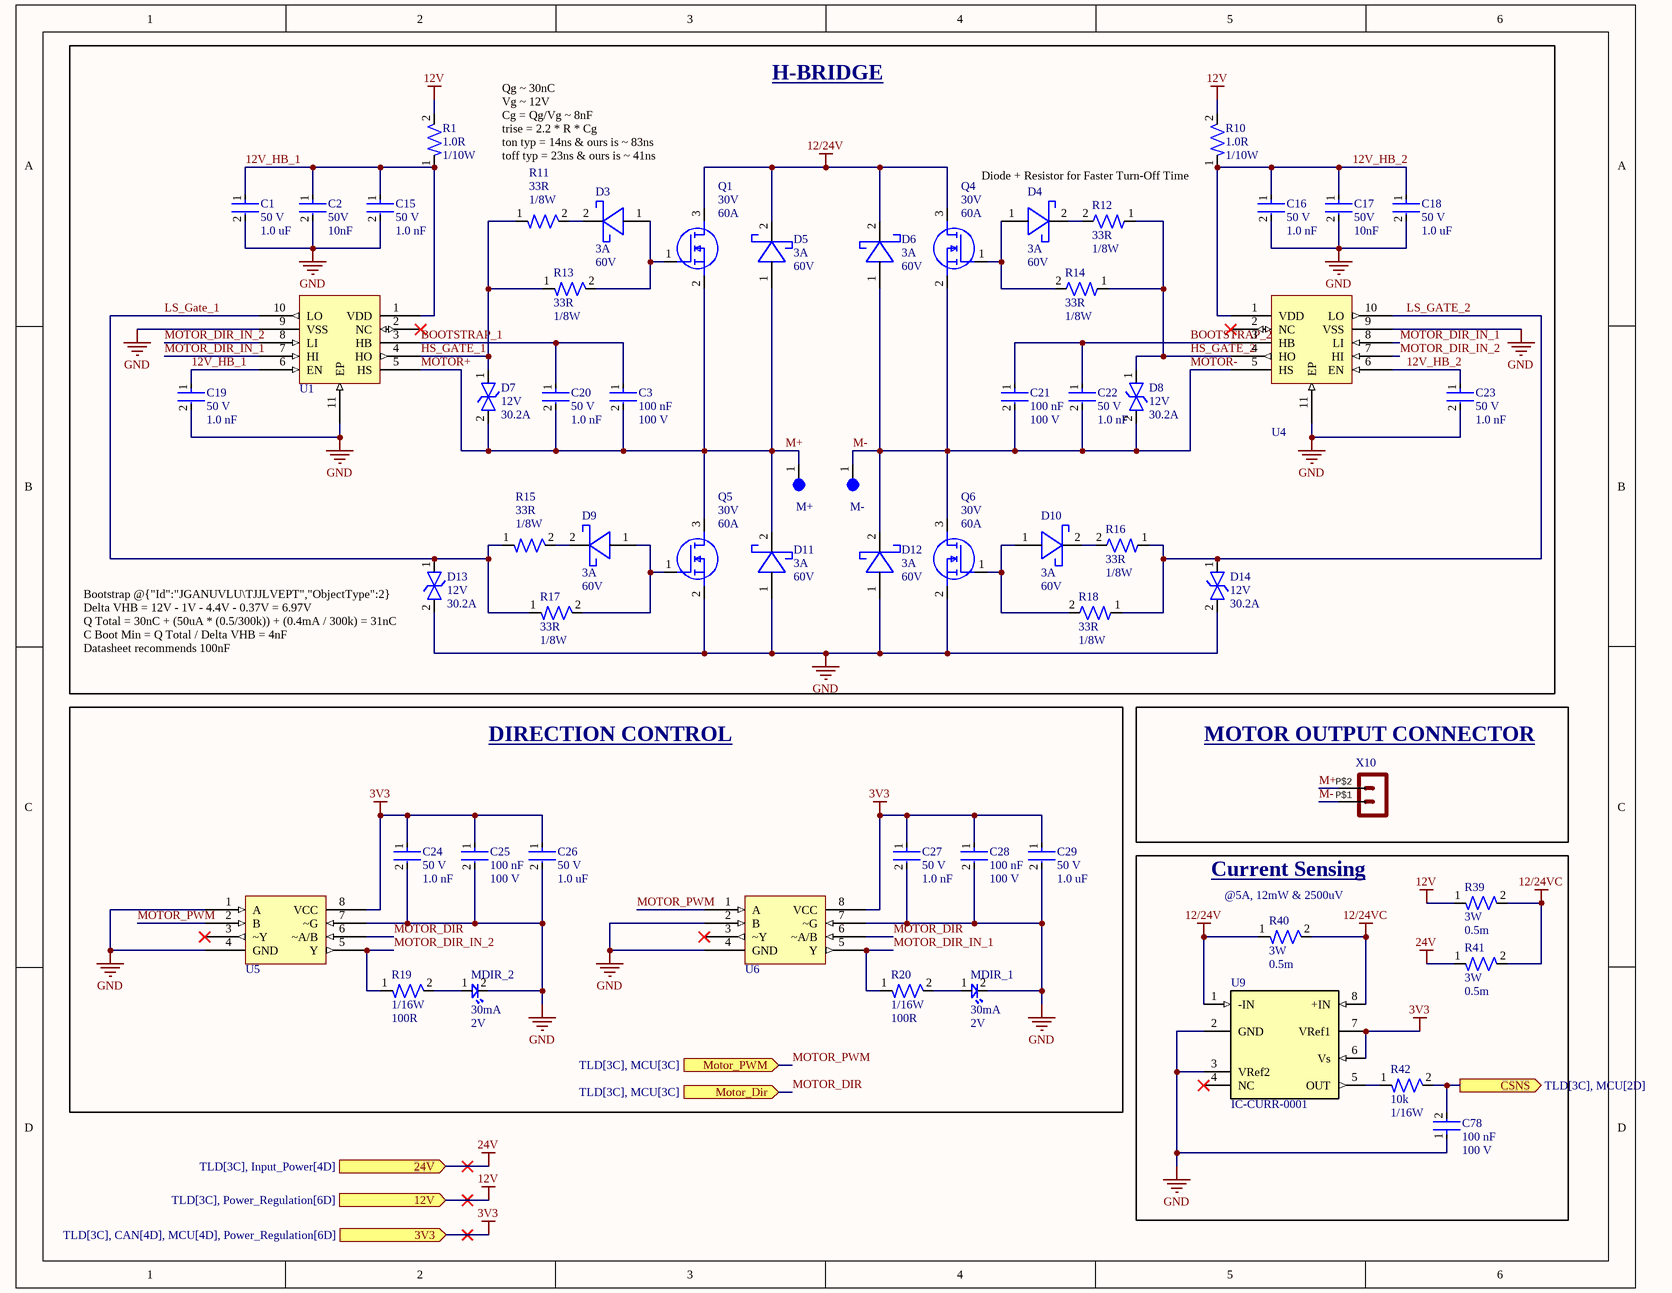
[diagram p4: Motor_Control.SchDoc]

### Parts
C1  Voltage: 50 V  Capacitance: 1.0 uF  [CAP-0805]  (hidden comment: CC0805KKX7R9BB105)
C2  Voltage: 50V  Capacitance: 10nF  [CAP-0805]  (hidden comment: GRM2195C1H103JA01D)
C3  Capacitance: 100 nF  Voltage: 100 V  [CAP-0603]  (hidden comment: CC0603KRX7R0BB104)
C15  Voltage: 50 V  Capacitance: 1.0 nF  [CAP-0402]  (hidden comment: CC0402KRX7R9BB102)
C16  Voltage: 50 V  Capacitance: 1.0 nF  [CAP-0402]  (hidden comment: CC0402KRX7R9BB102)
C17  Voltage: 50V  Capacitance: 10nF  [CAP-0805]  (hidden comment: GRM2195C1H103JA01D)
C18  Voltage: 50 V  Capacitance: 1.0 uF  [CAP-0805]  (hidden comment: CC0805KKX7R9BB105)
C19  Voltage: 50 V  Capacitance: 1.0 nF  [CAP-0402]  (hidden comment: CC0402KRX7R9BB102)
C20  Voltage: 50 V  Capacitance: 1.0 nF  [CAP-0402]  (hidden comment: CC0402KRX7R9BB102)
C21  Capacitance: 100 nF  Voltage: 100 V  [CAP-0603]  (hidden comment: CC0603KRX7R0BB104)
C22  Voltage: 50 V  Capacitance: 1.0 nF  [CAP-0402]  (hidden comment: CC0402KRX7R9BB102)
C23  Voltage: 50 V  Capacitance: 1.0 nF  [CAP-0402]  (hidden comment: CC0402KRX7R9BB102)
C24  Voltage: 50 V  Capacitance: 1.0 nF  [CAP-0402]  (hidden comment: CC0402KRX7R9BB102)
C25  Capacitance: 100 nF  Voltage: 100 V  [CAP-0603]  (hidden comment: CC0603KRX7R0BB104)
C26  Voltage: 50 V  Capacitance: 1.0 uF  [CAP-0805]  (hidden comment: CC0805KKX7R9BB105)
C27  Voltage: 50 V  Capacitance: 1.0 nF  [CAP-0402]  (hidden comment: CC0402KRX7R9BB102)
C28  Capacitance: 100 nF  Voltage: 100 V  [CAP-0603]  (hidden comment: CC0603KRX7R0BB104)
C29  Voltage: 50 V  Capacitance: 1.0 uF  [CAP-0805]  (hidden comment: CC0805KKX7R9BB105)
C78  Capacitance: 100 nF  Voltage: 100 V  [CAP-0603]  (hidden comment: CC0603KRX7R0BB104)
D3  Current Rating: 3A  Reverse Voltage: 60V  [DIO-SOD128]  (hidden comment: PMEG6030EP,115)
D4  Current Rating: 3A  Reverse Voltage: 60V  [DIO-SOD128]  (hidden comment: PMEG6030EP,115)
D5  Current Rating: 3A  Reverse Voltage: 60V  [DIO-SOD128]  (hidden comment: PMEG6030EP,115)
D6  Current Rating: 3A  Reverse Voltage: 60V  [DIO-SOD128]  (hidden comment: PMEG6030EP,115)
D7  Standoff Voltage: 12V  Current Rating: 30.2A  [DO-214AA (SMBJ)]  (hidden comment: SMBJ12CA)
D8  Standoff Voltage: 12V  Current Rating: 30.2A  [DO-214AA (SMBJ)]  (hidden comment: SMBJ12CA)
D9  Current Rating: 3A  Reverse Voltage: 60V  [DIO-SOD128]  (hidden comment: PMEG6030EP,115)
D10  Current Rating: 3A  Reverse Voltage: 60V  [DIO-SOD128]  (hidden comment: PMEG6030EP,115)
D11  Current Rating: 3A  Reverse Voltage: 60V  [DIO-SOD128]  (hidden comment: PMEG6030EP,115)
D12  Current Rating: 3A  Reverse Voltage: 60V  [DIO-SOD128]  (hidden comment: PMEG6030EP,115)
D13  Standoff Voltage: 12V  Current Rating: 30.2A  [DO-214AA (SMBJ)]  (hidden comment: SMBJ12CA)
D14  Standoff Voltage: 12V  Current Rating: 30.2A  [DO-214AA (SMBJ)]  (hidden comment: SMBJ12CA)
M+  5003  [TEST-POINT-0001]  (value not drawn)
M-  5003  [TEST-POINT-0001]  (value not drawn)
MDIR_1  Forward Current: 30mA  Forward Voltage: 2V  [LED-0603]  (hidden comment: BL-HKC36G-AV-TRB)
MDIR_2  Forward Current: 30mA  Forward Voltage: 2V  [LED-0603]  (hidden comment: BL-HKC36G-AV-TRB)
Q1  Voltage: 30V  Continuous Current: 60A  [IC-8VSONCLIP]  (hidden comment: CSD17575Q3)
Q4  Voltage: 30V  Continuous Current: 60A  [IC-8VSONCLIP]  (hidden comment: CSD17575Q3)
Q5  Voltage: 30V  Continuous Current: 60A  [IC-8VSONCLIP]  (hidden comment: CSD17575Q3)
Q6  Voltage: 30V  Continuous Current: 60A  [IC-8VSONCLIP]  (hidden comment: CSD17575Q3)
R1  Resistance: 1.0R  Power: 1/10W  [RES-0402]  (hidden comment: ERJ2GEJ1R0X)
R10  Resistance: 1.0R  Power: 1/10W  [RES-0402]  (hidden comment: ERJ2GEJ1R0X)
R11  Resistance: 33R  Power: 1/8W  [RES-0402]  (hidden comment: RC0402FR-7W33RL)
R12  Resistance: 33R  Power: 1/8W  [RES-0402]  (hidden comment: RC0402FR-7W33RL)
R13  Resistance: 33R  Power: 1/8W  [RES-0402]  (hidden comment: RC0402FR-7W33RL)
R14  Resistance: 33R  Power: 1/8W  [RES-0402]  (hidden comment: RC0402FR-7W33RL)
R15  Resistance: 33R  Power: 1/8W  [RES-0402]  (hidden comment: RC0402FR-7W33RL)
R16  Resistance: 33R  Power: 1/8W  [RES-0402]  (hidden comment: RC0402FR-7W33RL)
R17  Resistance: 33R  Power: 1/8W  [RES-0402]  (hidden comment: RC0402FR-7W33RL)
R18  Resistance: 33R  Power: 1/8W  [RES-0402]  (hidden comment: RC0402FR-7W33RL)
R19  Power: 1/16W  Resistance: 100R  [RES-0402]  (hidden comment: RC0402FR-07100RL)
R20  Power: 1/16W  Resistance: 100R  [RES-0402]  (hidden comment: RC0402FR-07100RL)
R39  Power: 3W  Resistance: 0.5m  [RES-2512]  (hidden comment: C337220)
R40  Power: 3W  Resistance: 0.5m  [RES-2512]  (hidden comment: C337220)
R41  Power: 3W  Resistance: 0.5m  [RES-2512]  (hidden comment: C337220)
R42  Resistance: 10k  Power: 1/16W  [RES-0402]  (hidden comment: RC0402FR-0710KL)
U1  UCC27282DRCR  [IC-10VSON]  (value not drawn)
U4  UCC27282DRCR  [IC-10VSON]  (value not drawn)
U5  SN74LVC2G157DCUR  [IC-8VSSOP]  (value not drawn)
U6  SN74LVC2G157DCUR  [IC-8VSSOP]  (value not drawn)
U9  IC-CURR-0001  [IC-CURR]
X10  Molex - Micro-Fit 3.0 Series connector,  3.00mm (0.118") pitch header, 2 positions.  [43650-0200]  (value not drawn)

### Blocks framed on the sheet
H-BRIDGE: C1-C3 C15-C23 D3-D14 M+ M- Q1 Q4-Q6 R1 R10-R18 U1 U4
DIRECTION CONTROL: C24-C29 MDIR_1 MDIR_2 R19 R20 U5 U6
MOTOR OUTPUT CONNECTOR: X10
Current Sensing: C78 R39-R42 U9

### Ports
3V3 (in, see TLD[3C], CAN[4D], MCU[4D], Power_Regulation[6D]), 12V (in, see TLD[3C], Power_Regulation[6D]), 24V (in, see TLD[3C], Input_Power[4D]), CSNS (out, see TLD[3C], MCU[2D]), Motor_Dir (in, see TLD[3C], MCU[3C]), Motor_PWM (in, see TLD[3C], MCU[3C])

### Nets
3V3: C24.1 C25.1 C26.1 C27.1 C28.1 C29.1 U5.8(VCC) U6.8(VCC) U9.6(Vs) U9.7(VRef1) ; port 3V3
12/24V: D5.2(ANODE) D6.2(ANODE) Q1.3(D) Q4.3(D) R40.1 U9.1(-IN)
12/24VC: R39.2 R40.2 R41.2 U9.8(+IN)
12V: R1.2 R10.2 R39.1 ; port 12V
24V: R41.1 ; port 24V
GND: C1.2 C2.2 C15.2 C16.2 C17.2 C18.2 C19.2 C23.2 C24.2 C25.2 C26.2 C27.2 C28.2 C29.2 C78.1 D11.1(CATHODE) D12.1(CATHODE) D13.2 D14.2 MDIR_1.2 MDIR_2.2 Q5.2(S) Q6.2(S) U1.9(VSS) U1.11(EP) U4.9(VSS) U4.11(EP) U5.1(A) U5.4(GND) U5.7(~G) U6.2(B) U6.4(GND) U6.7(~G) U9.2(GND) U9.3(VRef2)
12V_HB_1: C1.1 C2.1 C15.1 C19.1 R1.1 U1.1(VDD) U1.6(EN)
12V_HB_2: C16.1 C17.1 C18.1 C23.1 R10.1 U4.1(VDD) U4.6(EN)
BOOTSTRAP_1: C3.1 C20.1 U1.3(HB)
BOOTSTRAP_2: C21.1 C22.1 U4.3(HB)
CSNS: C78.2 R42.2 ; port CSNS
HS_GATE_1: D7.1 R11.1 R13.1 U1.4(HO)
HS_GATE_2: D8.1 R12.1 R14.1 U4.4(HO)
LS_Gate_1: D13.1 R15.1 R17.1 U1.10(LO)
LS_GATE_2: D14.1 R16.1 R18.1 U4.10(LO)
M+: C3.2 C20.2 D5.1(CATHODE) D7.2 D11.2(ANODE) M+.1 Q1.2(S) Q5.3(D) U1.5(HS) X10.P$2  [also labelled MOTOR+]
M-: C21.2 C22.2 D6.1(CATHODE) D8.2 D12.2(ANODE) M-.1 Q4.2(S) Q6.3(D) U4.5(HS) X10.P$1  [also labelled MOTOR-]
MOTOR_DIR: U5.6(~A/B) U6.6(~A/B) ; port Motor_Dir
MOTOR_DIR_IN_1: R20.1 U1.7(HI) U4.8(LI) U6.5(Y)
MOTOR_DIR_IN_2: R19.1 U1.8(LI) U4.7(HI) U5.5(Y)
MOTOR_PWM: U5.2(B) U6.1(A) ; port Motor_PWM
NetD3_1: D3.1(CATHODE) Q1.1(G) R13.2
NetD3_2: D3.2(ANODE) R11.2
NetD4_1: D4.1(CATHODE) Q4.1(G) R14.2
NetD4_2: D4.2(ANODE) R12.2
NetD9_1: D9.1(CATHODE) Q5.1(G) R17.2
NetD9_2: D9.2(ANODE) R15.2
NetD10_1: D10.1(CATHODE) Q6.1(G) R18.2
NetD10_2: D10.2(ANODE) R16.2
NetMDIR_1_1: MDIR_1.1 R20.2
NetMDIR_2_1: MDIR_2.1 R19.2
NetR42_1: R42.1 U9.5(OUT)

Not connected (* = marked no-connect by the designer): U1 2(NC)*; U4 2(NC)*; U5 3(~Y)*; U6 3(~Y)*; U9 4(NC)*

### Notes on the sheet
- Qg ~ 30nC
  Vg ~ 12V
  Cg = Qg/Vg ~ 8nF
  trise = 2.2 * R * Cg
  ton typ = 14ns & ours is ~ 83ns
  toff typ = 23ns & ours is ~ 41ns
- (near R10) Diode + Resistor for Faster Turn-Off Time
- (near D13) Bootstrap @{"Id":"JGANUVLU\TJJLVEPT","ObjectType":2}
  Delta VHB = 12V - 1V - 4.4V - 0.37V = 6.97V
  Q Total = 30nC + (50uA * (0.5/300k)) + (0.4mA / 300k) = 31nC
  C Boot Min = Q Total / Delta VHB = 4nF
  Datasheet recommends 100nF
- (near R40) @5A, 12mW & 2500uV

### Library data of the parts
C1 C18 C26 C29 = CAP-1U-0001: CAP CER 1UF 50V X7R 0805; ComponentLink2URL: https://www.yageo.com/upload/media/product/productsearch/datasheet/mlcc/UPY-GPHC_X7R_6.3V-to-250V_24.pdf; ComponentLink2Description: Datasheet; Device Class: Ceramic; Size: 0805
C2 C17 = CAP-10N-0001: CAP CER 10000PF 50V C0G/NP0 0805; Device Class: Ceramic; Size: 0805; ComponentLink1Description: Datasheet; ComponentLink1URL: https://search.murata.co.jp/Ceramy/image/img/A01X/G101/ENG/GRM2195C1H103JA01-01.pdf
C3 C21 C25 C28 C78 = CAP-100N-0001: CAP CER 0.1UF 100V X7R 0603; Device Class: Ceramic; Size: 0603; ComponentLink1Description: Datasheet; ComponentLink1URL: https://www.yageo.com/upload/media/product/app/datasheet/mlcc/upy-np0x7r_mv_100-to-630v.pdf
C15 C16 C19 C20 C22-C24 C27 = CAP-1N-0001: CAP CER 1000PF 50V X7R 0402; ComponentLink2Description: Datasheet; ComponentLink2URL: http://www.yageo.com/documents/recent/UPY-GP_NP0_16V-to-50V_16.pdf; Device Class: Ceramic; Size: 0402
D3-D6 D9-D12 = DIO-SCHOTTKY-0003: DIODE SCHOTTKY 60V 3A SOD128; ComponentLink1Description: Datasheet; ComponentLink1URL: https://assets.nexperia.com/documents/data-sheet/PMEG6030EP.pdf
D7 D8 D13 D14 = DIO-TVS-0002: TVS DIODE 12VWM 19.9VC DO214AA; ComponentLink1Description: Datasheet; ComponentLink1URL: https://www.littelfuse.com/media?resourcetype=datasheets&itemid=09a6ae9a-73cb-4ac4-acac-e6dab92ab953&filename=littelfuse_tvs_diode_smbj_datasheet.pdf
M+ M- = TEST-POINT-0001: as 24V on sheet Input_Power
MDIR_1 MDIR_2 = LED-0001: LED YELLOW CLEAR 0603 SMD; ComponentLink1Description: Datasheet; ComponentLink1URL: https://www.americanbrightled.com/pdffiles/led-components/smt/BL-HKC36G-AV-TRB.pdf
Q1 Q4-Q6 = NMOS-26A-0001: MOSFET N-CH 30V 60A 8VSON; ComponentLink1Description: Datasheet; ComponentLink1URL: https://www.ti.com/lit/ds/symlink/csd17575q3.pdf?ts=1728565072242&ref_url=https%253A%252F%252Fwww.mouser.co.uk%252F
R1 R10 = RES-1-0001: RES SMD 1 OHM 5% 1/10W 0402; Tolerance: 5%; ComponentLink1Description: Datasheet; ComponentLink1URL: https://api.pim.na.industrial.panasonic.com/file_stream/main/fileversion/1242; Size: 0402
R11-R18 = RES-33-0001: RES 33 OHM 1% 1/8W 0402; Tolerance: 1%; Size: 0402; ComponentLink1Description: Datasheet; ComponentLink1URL: https://www.yageo.com/upload/media/product/products/datasheet/rchip/PYu-RC_Group_51_RoHS_L_12.pdf
R19 R20 = RES-100-0001: RES 100 OHM 1% 1/16W 0402; Tolerance: 1%; Size: 0402; ComponentLink1Description: Datasheet; ComponentLink1URL: https://www.yageo.com/upload/media/product/products/datasheet/rchip/PYu-RC_Group_51_RoHS_L_12.pdf
R39-R41 = RES-0.5m-0001: 2512 Chip Resistor - Surface Mount ROHS; Tolerance: 1%; Size: 0402; ComponentLink1Description: Datasheet; ComponentLink1URL: https://www.yageo.com/upload/media/product/products/datasheet/rchip/PYu-RC_Group_51_RoHS_L_12.pdf
R42 = RES-10k-0001: RES 10K OHM 1% 1/16W 0402; Tolerance: 1%; Size: 0402; ComponentLink1Description: Datasheet; ComponentLink1URL: https://www.yageo.com/upload/media/product/products/datasheet/rchip/PYu-RC_Group_51_RoHS_L_12.pdf
U1 U4 = IC-GTDR-0001: IC GATE DRVR HALF-BRIDGE 10VSON; VCC Max: 16; Package: 10-VSON; ComponentLink1Description: Datasheet; ComponentLink1URL: https://www.ti.com/lit/ds/symlink/ucc27282.pdf?HQS=dis-dk-null-digikeymode-dsf-pf-null-wwe&ts=1728563165008&ref_url=https%253A%252F%252Fwww.ti.com
U5 U6 = IC-MUX-0001: Multiplexer 1 x 2:1 8-VSSOP; ComponentLink1Description: Datasheet; ComponentLink1URL: https://www.ti.com/general/docs/suppproductinfo.tsp?distId=10&gotoUrl=https%3A%2F%2Fwww.ti.com%2Flit%2Fgpn%2Fsn74lvc2g157
U9 = IC-CURR-0001: Current Sense Amplifier 1 Circuit 8-MSOP
X10 = HEADER_POS2_?43650-0200

## Sheet Power_Regulation.SchDoc
size 457 x 241 mm; SheetNumber: 4; SheetTotal: 6
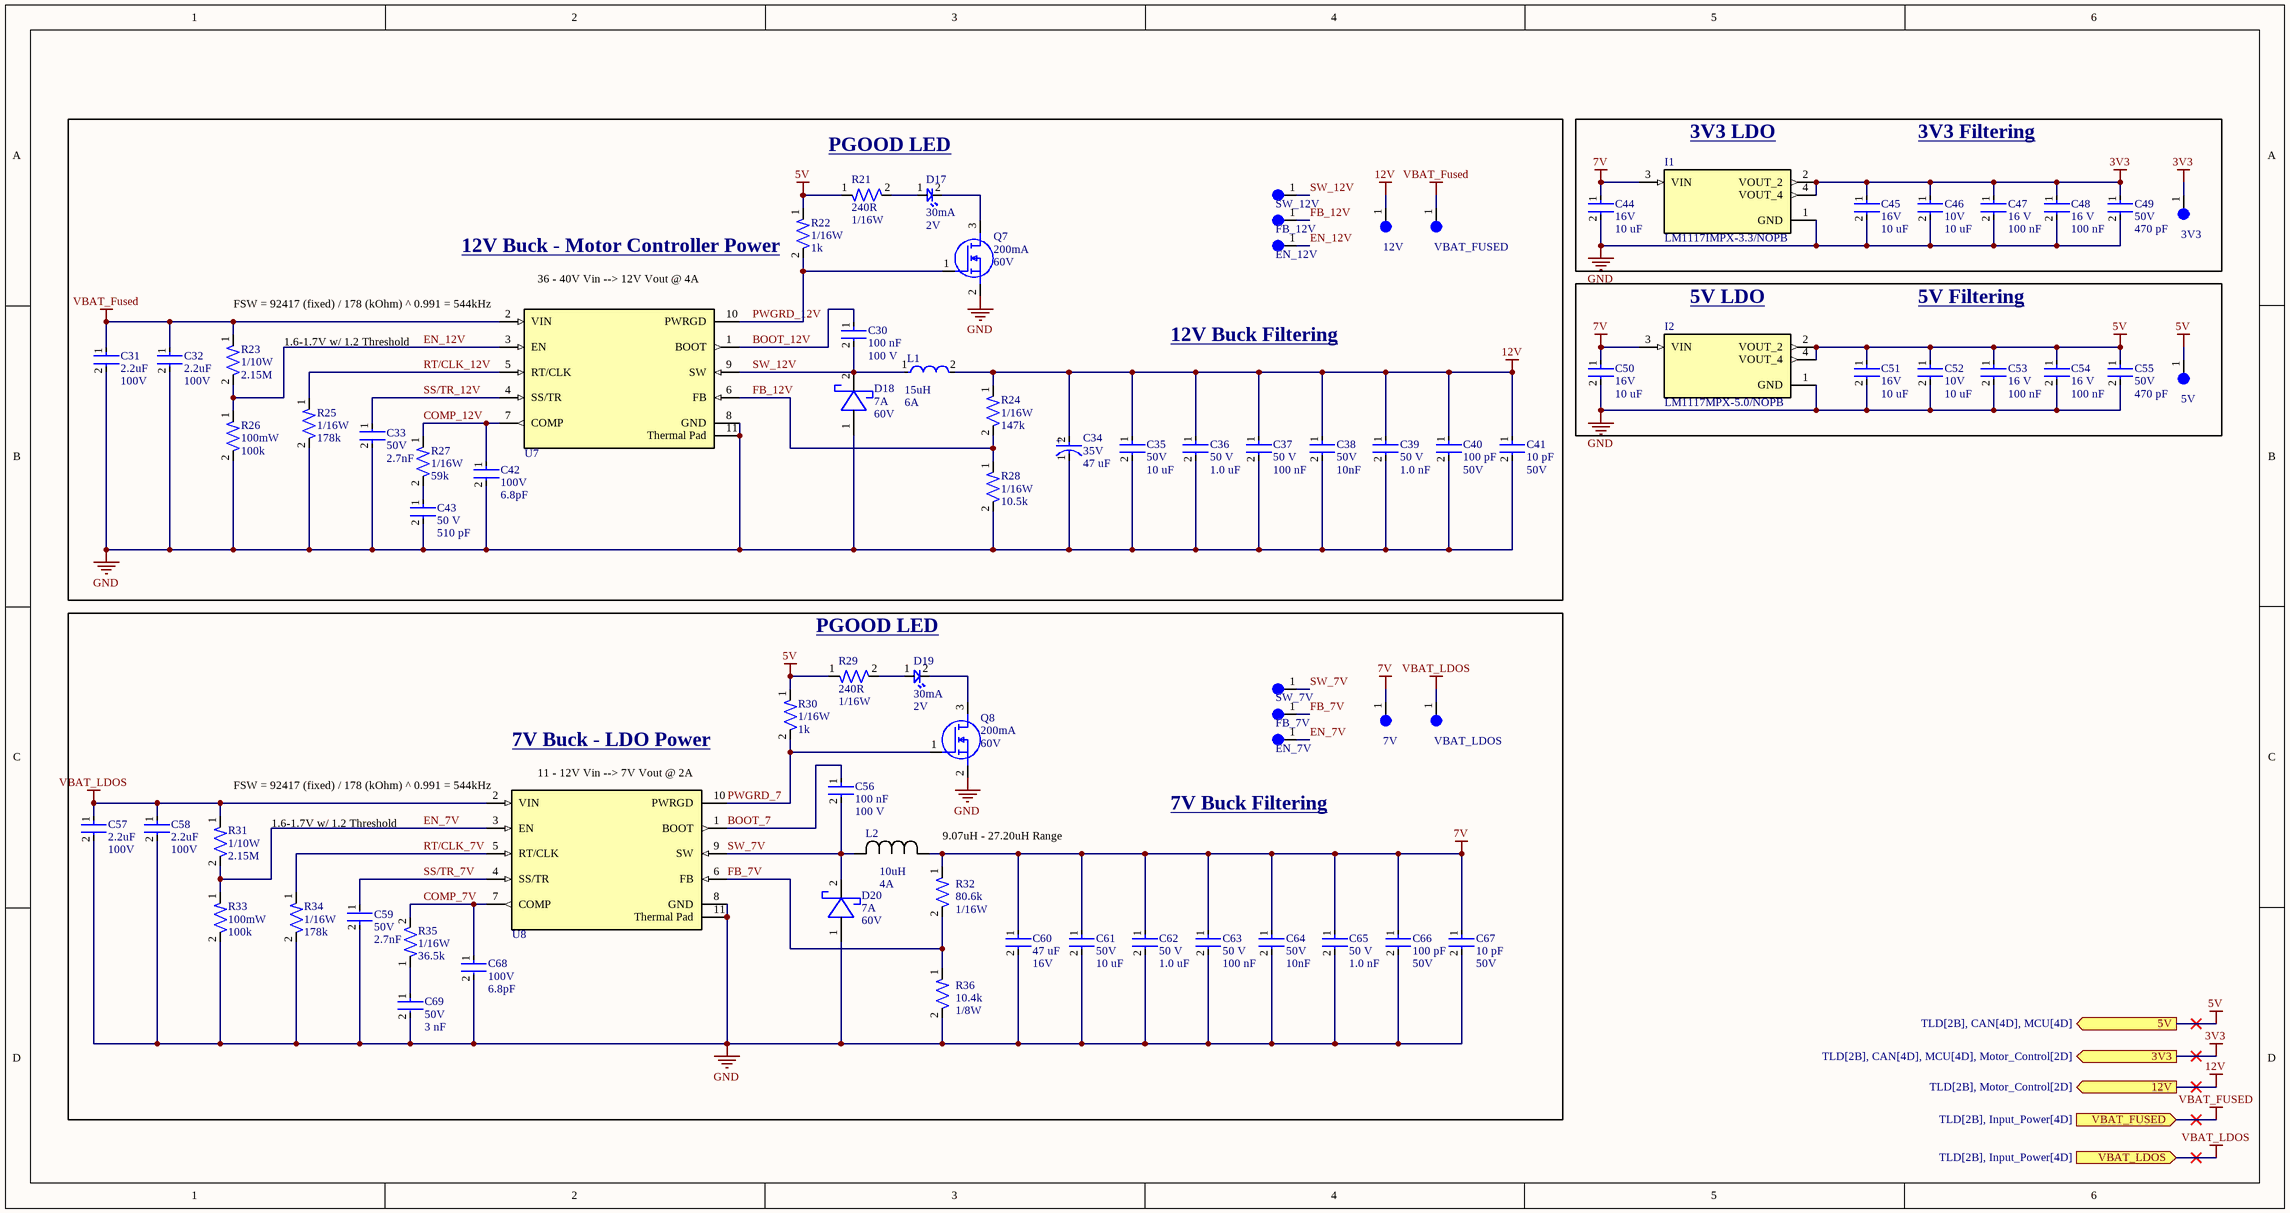
[diagram p5: Power_Regulation.SchDoc]

### Parts
3V3  5003  [TEST-POINT-0001]  (value not drawn)
5V  5003  [TEST-POINT-0001]  (value not drawn)
7V  5003  [TEST-POINT-0001]  (value not drawn)
12V  5003  [TEST-POINT-0001]  (value not drawn)
C30  Capacitance: 100 nF  Voltage: 100 V  [CAP-0603]  (hidden comment: CC0603KRX7R0BB104)
C31  Capacitance: 2.2uF  Voltage: 100V  [CAP-1206]  (hidden comment: CC1206KKX7R0BB225)
C32  Capacitance: 2.2uF  Voltage: 100V  [CAP-1206]  (hidden comment: CC1206KKX7R0BB225)
C33  Voltage: 50V  Capacitance: 2.7nF  [CAP-0805]  (hidden comment: GRM2165C1H272JA01D)
C34  Voltage: 35V  Capacitance: 47 uF  [CAP-Radial-SMD]  (hidden comment: EEH-ZC1V470P)
C35  Voltage: 50V  Capacitance: 10 uF  [CAP-1210]  (hidden comment: CL32B106KBJNNNE)
C36  Voltage: 50 V  Capacitance: 1.0 uF  [CAP-0805]  (hidden comment: CC0805KKX7R9BB105)
C37  Voltage Rating: 50 V  Capacitance: 100 nF  [CAP-0805]  (hidden comment: CC0805KRX7R9BB104)
C38  Voltage: 50V  Capacitance: 10nF  [CAP-0805]  (hidden comment: GRM2195C1H103JA01D)
C39  Voltage: 50 V  Capacitance: 1.0 nF  [CAP-0402]  (hidden comment: CC0402KRX7R9BB102)
C40  Capacitance: 100 pF  Voltage: 50V  [CAP-0402]  (hidden comment: CC0402JRNPO9BN101)
C41  Capacitance: 10 pF  Voltage: 50V  [CAP-0402]  (hidden comment: CC0402JRNPO9BN100)
C42  Voltage: 100V  Capacitance: 6.8pF  [CAP-0603]  (hidden comment: CC0603CRNPO0BN6R8)
C43  Voltage: 50 V  Capacitance: 510 pF  [CAP-0402]  (hidden comment: 0402N511J500CT)
C44  Voltage: 16V  Capacitance: 10 uF  [CAP-1206]  (hidden comment: 293D106X9016A2TE3)
C45  Voltage: 16V  Capacitance: 10 uF  [CAP-1206]  (hidden comment: 293D106X9016A2TE3)
C46  Voltage: 10V  Capacitance: 10 uF  [CAP-0603]  (hidden comment: CC0603KRX5R6BB106)
C47  Voltage Rating: 16 V  Capacitance: 100 nF  [CAP-0402]  (hidden comment: CC0402KRX7R7BB104)
C48  Voltage Rating: 16 V  Capacitance: 100 nF  [CAP-0402]  (hidden comment: CC0402KRX7R7BB104)
C49  Voltage: 50V  Capacitance: 470 pF  [CAP-0805]  (hidden comment: CC0805JRNPO9BN471)
C50  Voltage: 16V  Capacitance: 10 uF  [CAP-1206]  (hidden comment: 293D106X9016A2TE3)
C51  Voltage: 16V  Capacitance: 10 uF  [CAP-1206]  (hidden comment: 293D106X9016A2TE3)
C52  Voltage: 10V  Capacitance: 10 uF  [CAP-0603]  (hidden comment: CC0603KRX5R6BB106)
C53  Voltage Rating: 16 V  Capacitance: 100 nF  [CAP-0402]  (hidden comment: CC0402KRX7R7BB104)
C54  Voltage Rating: 16 V  Capacitance: 100 nF  [CAP-0402]  (hidden comment: CC0402KRX7R7BB104)
C55  Voltage: 50V  Capacitance: 470 pF  [CAP-0805]  (hidden comment: CC0805JRNPO9BN471)
C56  Capacitance: 100 nF  Voltage: 100 V  [CAP-0603]  (hidden comment: CC0603KRX7R0BB104)
C57  Capacitance: 2.2uF  Voltage: 100V  [CAP-1206]  (hidden comment: CC1206KKX7R0BB225)
C58  Capacitance: 2.2uF  Voltage: 100V  [CAP-1206]  (hidden comment: CC1206KKX7R0BB225)
C59  Voltage: 50V  Capacitance: 2.7nF  [CAP-0805]  (hidden comment: GRM2165C1H272JA01D)
C60  Capacitance: 47 uF  Voltage: 16V  [CAP-1210]  (hidden comment: C3225X7R1N106K250AC)
C61  Voltage: 50V  Capacitance: 10 uF  [CAP-1210]  (hidden comment: CL32B106KBJNNNE)
C62  Voltage: 50 V  Capacitance: 1.0 uF  [CAP-0805]  (hidden comment: CC0805KKX7R9BB105)
C63  Voltage Rating: 50 V  Capacitance: 100 nF  [CAP-0805]  (hidden comment: CC0805KRX7R9BB104)
C64  Voltage: 50V  Capacitance: 10nF  [CAP-0805]  (hidden comment: GRM2195C1H103JA01D)
C65  Voltage: 50 V  Capacitance: 1.0 nF  [CAP-0402]  (hidden comment: CC0402KRX7R9BB102)
C66  Capacitance: 100 pF  Voltage: 50V  [CAP-0402]  (hidden comment: CC0402JRNPO9BN101)
C67  Capacitance: 10 pF  Voltage: 50V  [CAP-0402]  (hidden comment: CC0402JRNPO9BN100)
C68  Voltage: 100V  Capacitance: 6.8pF  [CAP-0603]  (hidden comment: CC0603CRNPO0BN6R8)
C69  Voltage: 50V  Capacitance: 3 nF  [CAP-0603]  (hidden comment: GRM1885C1H302JA01D)
D17  Forward Current: 30mA  Forward Voltage: 2V  [LED-0603]  (hidden comment: BL-HKC36G-AV-TRB)
D18  Forward Current: 7A  Reverse Voltage (DC): 60V  [DO-POWERDI5]  (hidden comment: PDS760-13)
D19  Forward Current: 30mA  Forward Voltage: 2V  [LED-0603]  (hidden comment: BL-HKC36G-AV-TRB)
D20  Forward Current: 7A  Reverse Voltage (DC): 60V  [DO-POWERDI5]  (hidden comment: PDS760-13)
EN_7V  5003  [TEST-POINT-0001]  (value not drawn)
EN_12V  5003  [TEST-POINT-0001]  (value not drawn)
FB_7V  5003  [TEST-POINT-0001]  (value not drawn)
FB_12V  5003  [TEST-POINT-0001]  (value not drawn)
I1  LM1117IMPX-3.3/NOPB  [IC-SOT-223-4]
I2  LM1117MPX-5.0/NOPB  [IC-SOT-223-4]
L1  Inductance: 15uH  Current Rating: 6A  [IND-15U-0002]  (hidden comment: CSAD1010-150M)
L2  Current: 4A  Inductance: 10uH  [IND_IHLP_2525_CZ_VIS]  (hidden comment: IHLP2525CZER100M11)
Q7  Continuous Current: 200mA  Voltage: 60V  [IC-SOT23-3]  (hidden comment: T2N7002AK,LM)
Q8  Continuous Current: 200mA  Voltage: 60V  [IC-SOT23-3]  (hidden comment: T2N7002AK,LM)
R21  Resistance: 240R  Power: 1/16W  [RES-0402]  (hidden comment: RC0402FR-07240RL)
R22  Power: 1/16W  Resistance: 1k  [RES-0402]  (hidden comment: RC0402FR-071KL)
R23  Power: 1/10W  Resistance: 2.15M  [RES-0603]  (hidden comment: RC0603FR-072M15L)
R24  Power: 1/16W  Resistance: 147k  [RES-0402]  (hidden comment: RC0402FR-07147KL)
R25  Power: 1/16W  Resistance: 178k  [RES-0402]  (hidden comment: RTT021783FTH)
R26  Power: 100mW  Resistance: 100k  [RES-0603]  (hidden comment: RC0603FR-07100KL)
R27  Power: 1/16W  Resistance: 59k  [RES-0402]  (hidden comment: RC0402FR-0759KL)
R28  Power: 1/16W  Resistance: 10.5k  [RES-0402]  (hidden comment: RC0402FR-0710K5L)
R29  Resistance: 240R  Power: 1/16W  [RES-0402]  (hidden comment: RC0402FR-07240RL)
R30  Power: 1/16W  Resistance: 1k  [RES-0402]  (hidden comment: RC0402FR-071KL)
R31  Power: 1/10W  Resistance: 2.15M  [RES-0603]  (hidden comment: RC0603FR-072M15L)
R32  Resistance: 80.6k  Power: 1/16W  [RES-0402]  (hidden comment: RC0402FR-0780K6L)
R33  Power: 100mW  Resistance: 100k  [RES-0603]  (hidden comment: RC0603FR-07100KL)
R34  Power: 1/16W  Resistance: 178k  [RES-0402]  (hidden comment: RTT021783FTH)
R35  Power: 1/16W  Resistance: 36.5k  [RES-0402]  (hidden comment: RC0402FR-0736K5L)
R36  Power: 1/8W  Resistance: 10.4k  [RES-0805]  (hidden comment: RT0805BRD0710K4L)
SW_7V  5003  [TEST-POINT-0001]  (value not drawn)
SW_12V  5003  [TEST-POINT-0001]  (value not drawn)
U7  TPS54561DPRR  [IC-10WSON]  (value not drawn)
U8  TPS54561DPRR  [IC-10WSON]  (value not drawn)
VBAT_FUSED  5003  [TEST-POINT-0001]  (value not drawn)
VBAT_LDOS  5003  [TEST-POINT-0001]  (value not drawn)

### Ports
3V3 (out, see TLD[2B], CAN[4D], MCU[4D], Motor_Control[2D]), 5V (out, see TLD[2B], CAN[4D], MCU[4D]), 12V (out, see TLD[2B], Motor_Control[2D]), VBAT_FUSED (in, see TLD[2B], Input_Power[4D]), VBAT_LDOS (in, see TLD[2B], Input_Power[4D])

### Nets
3V3: 3V3.1 C45.1 C46.1 C47.1 C48.1 C49.1 I1.2(VOUT_2) I1.4(VOUT_4) ; port 3V3
5V: 5V.1 C51.1 C52.1 C53.1 C54.1 C55.1 I2.2(VOUT_2) I2.4(VOUT_4) R21.1 R22.1 R29.1 R30.1 ; port 5V
7V: 7V.1 C44.1 C50.1 C60.1 C61.1 C62.1 C63.1 C64.1 C65.1 C66.1 C67.1 I1.3(VIN) I2.3(VIN) L2.1 R32.1
12V: 12V.1 C34.2(A) C35.1 C36.1 C37.1 C38.1 C39.1 C40.1 C41.1 L1.2 R24.1 ; port 12V
GND: C31.2 C32.2 C33.2 C34.1(C) C35.2 C36.2 C37.2 C38.2 C39.2 C40.2 C41.2 C42.2 C43.2 C44.2 C45.2 C46.2 C47.2 C48.2 C49.2 C50.2 C51.2 C52.2 C53.2 C54.2 C55.2 C57.2 C58.2 C59.2 C60.2 C61.2 C62.2 C63.2 C64.2 C65.2 C66.2 C67.2 C68.2 C69.2 D18.1(CATHODE) D20.1(CATHODE) I1.1(GND) I2.1(GND) Q7.2(S) Q8.2(S) R25.2 R26.2 R28.2 R33.2 R34.2 R36.2 U7.8(GND) U7.11(Thermal_Pad) U8.8(GND) U8.11(Thermal_Pad)
VBAT_FUSED: C31.1 C32.1 R23.1 U7.2(VIN) VBAT_FUSED.1 ; port VBAT_FUSED
VBAT_LDOS: C57.1 C58.1 R31.1 U8.2(VIN) VBAT_LDOS.1 ; port VBAT_LDOS
BOOT_7: C56.1 U8.1(BOOT)
BOOT_12V: C30.1 U7.1(BOOT)
COMP_7V: C68.1 R35.2 U8.7(COMP)
COMP_12V: C42.1 R27.1 U7.7(COMP)
EN_7V: EN_7V.1 R31.2 R33.1 U8.3(EN)
EN_12V: EN_12V.1 R23.2 R26.1 U7.3(EN)
FB_7V: FB_7V.1 R32.2 R36.1 U8.6(FB)
FB_12V: FB_12V.1 R24.2 R28.1 U7.6(FB)
PWGRD_7: Q8.1(G) R30.2 U8.10(PWRGD)
PWGRD_12V: Q7.1(G) R22.2 U7.10(PWRGD)
RT/CLK_7V: R34.1 U8.5(RT/CLK)
RT/CLK_12V: R25.1 U7.5(RT/CLK)
SS/TR_7V: C59.1 U8.4(SS/TR)
SS/TR_12V: C33.1 U7.4(SS/TR)
SW_7V: C56.2 D20.2(ANODE) L2.2 SW_7V.1 U8.9(SW)
SW_12V: C30.2 D18.2(ANODE) L1.1 SW_12V.1 U7.9(SW)
NetC43_1: C43.1 R27.2
NetC69_1: C69.1 R35.1
NetD17_1: D17.1 R21.2
NetD17_2: D17.2 Q7.3(D)
NetD19_1: D19.1 R29.2
NetD19_2: D19.2 Q8.3(D)

### Notes on the sheet
- PGOOD LED
- (near I1) 3V3 LDO
- 3V3 Filtering
- (near R22) 12V Buck - Motor Controller Power
- (near U7) 36 - 40V Vin --> 12V Vout @ 4A
- FSW = 92417 (fixed) / 178 (kOhm) ^ 0.991 = 544kHz
- 1.6-1.7V w/ 1.2 Threshold
- 12V Buck Filtering
- (near I2) 5V LDO
- 5V Filtering
- 7V Buck - LDO Power
- (near U8) 11 - 12V Vin --> 7V Vout @ 2A
- (near U8) FSW = 92417 (fixed) / 178 (kOhm) ^ 0.991 = 544kHz
- 9.07uH - 27.20uH Range
- 7V Buck Filtering
- (in symbol CAP-47U-0002) +

### Library data of the parts
3V3 5V 7V 12V EN_7V EN_12V FB_7V FB_12V SW_7V SW_12V VBAT_FUSED VBAT_LDOS = TEST-POINT-0001: as 24V on sheet Input_Power
C30 C56 = CAP-100N-0001: CAP CER 0.1UF 100V X7R 0603; Device Class: Ceramic; Size: 0603; ComponentLink1Description: Datasheet; ComponentLink1URL: https://www.yageo.com/upload/media/product/app/datasheet/mlcc/upy-np0x7r_mv_100-to-630v.pdf
C31 C32 C57 C58 = CAP-2.2U-0001: CAP CER 2.2UF 100V X7R 1206; Device Class: Ceramic; Size: 1206; ComponentLink1Description: Datasheet; ComponentLink1URL: https://www.yageo.com/upload/media/product/productsearch/datasheet/mlcc/UPY-GPHC_X7R_6.3V-to-250V_24.pdf
C33 C59 = CAP-2.7N-0001: CAP CER 2700PF 50V C0G/NP0 0805; ComponentLink1Description: Datasheet; ComponentLink1URL: https://search.murata.co.jp/Ceramy/image/img/A01X/G101/ENG/GRM2165C1H272JA01-01.pdf; Device Class: Ceramic; Size: 0805
C34 = CAP-47U-0002: CAP ALUM HYBRID 47UF 20% 35V SMD; Device Class: Electrolytic; ComponentLink1Description: Datasheet; ComponentLink1URL: https://industrial.panasonic.com/cdbs/www-data/pdf/RDD0000/ABA0000C1234.pdf
C35 C61 = CAP-10U-0002: CAP CER 10UF 50V X7R 1210; Device Class: Ceramic; Size: 1210; ComponentLink1Description: Datasheet; ComponentLink1URL: https://mm.digikey.com/Volume0/opasdata/d220001/medias/docus/41/CL32B106KBJNNNE_Spec.pdf
C36 C62 = CAP-1U-0001: CAP CER 1UF 50V X7R 0805; ComponentLink2URL: https://www.yageo.com/upload/media/product/productsearch/datasheet/mlcc/UPY-GPHC_X7R_6.3V-to-250V_24.pdf; ComponentLink2Description: Datasheet; Device Class: Ceramic; Size: 0805
C37 C63 = CAP-0.1U-0002: CAP CER 0.1UF 50V X7R 0805; ComponentLink2Description: Datasheet; ComponentLink2URL: https://www.yageo.com/upload/media/product/productsearch/datasheet/mlcc/UPY-GPHC_X7R_6.3V-to-250V_24.pdf; Device Class: Ceramic; Size: 0805
C38 C64 = CAP-10N-0001: CAP CER 10000PF 50V C0G/NP0 0805; Device Class: Ceramic; Size: 0805; ComponentLink1Description: Datasheet; ComponentLink1URL: https://search.murata.co.jp/Ceramy/image/img/A01X/G101/ENG/GRM2195C1H103JA01-01.pdf
C39 C65 = CAP-1N-0001: CAP CER 1000PF 50V X7R 0402; ComponentLink2Description: Datasheet; ComponentLink2URL: http://www.yageo.com/documents/recent/UPY-GP_NP0_16V-to-50V_16.pdf; Device Class: Ceramic; Size: 0402
C40 C66 = CAP-100P-0001: CAP CER 100PF 50V C0G/NPO 0402; Device Class: Ceramic; Size: 0402; ComponentLink1Description: Datasheet; ComponentLink1URL: https://www.yageo.com/upload/media/product/productsearch/datasheet/mlcc/UPY-GP_NP0_16V-to-50V_18.pdf
C41 C67 = CAP-10P-0001: CAP CER 10PF 50V C0G/NPO 0402; Device Class: Ceramic; Size: 0402; ComponentLink1Description: Datasheet; ComponentLink1URL: https://www.yageo.com/upload/media/product/productsearch/datasheet/mlcc/UPY-GP_NP0_16V-to-50V_18.pdf
C42 C68 = CAP-6.8P-0001: CAP CER 6.8PF 100V C0G/NPO 0603; Device Class: Ceramic; ComponentLink1Description: Datasheet; ComponentLink1URL: https://www.yageo.com/upload/media/product/productsearch/datasheet/mlcc/UPY-GPHC_X7R_6.3V-to-250V_24.pdf; Size: 0603
C43 = CAP-510P-0001: CAP CER 510PF 50V C0G/NP0 0402; ComponentLink2Description: Datasheet; ComponentLink2URL: https://www.mouser.com/ProductDetail/Walsin/0402N511J500CT?qs=u16ybLDytRbq33ukPPRl4A%3D%3D&srsltid=AfmBOoq1-HCbTRqPV3GtwyI6lHLBf095DSA3Qg1Qkiix4a-obr82TmJ6; Device Class: Ceramic; Size: 0402
C44 C45 C50 C51 = CAP-10U-0004: CAP TANT 10UF 10% 16V 1206; Device Class: Tantalum; Size: 1206; ComponentLink1Description: Datasheet; ComponentLink1URL: https://www.lcsc.com/datasheet/lcsc_datasheet_2304140030_Vishay-Intertech-293D106X9016A2TE3_C110038.pdf
C46 C52 = CAP-10U-0001: CAP CER 10UF 10V X5R 0603; ComponentLink1Description: Datasheet; ComponentLink1URL: https://www.yageo.com/upload/media/product/app/datasheet/mlcc/upy-gphc_x5r_4v-to-50v.pdf; Device Class: Ceramic; Size: 0603
C47 C48 C53 C54 = CAP-0.1U-0001: CAP CER 0.1UF 16V X7R 0402; ComponentLink2Description: Datasheet; ComponentLink2URL: https://www.yageo.com/upload/media/product/productsearch/datasheet/mlcc/UPY-GPHC_X7R_6.3V-to-250V_24.pdf; Device Class: Ceramic; Size: 0402
C49 C55 = CAP-470P-0001: CAP CER 470PF 50V C0G/NPO 0805; Device Class: Ceramic; Size: 0805; ComponentLink1Description: Datasheet; ComponentLink1URL: https://www.yageo.com/upload/media/product/productsearch/datasheet/mlcc/UPY-GP_NP0_16V-to-50V_18.pdf
C60 = CAP-47U-0003: CAP CER 47UF 16V X5R 1210; Device Class: Ceramic; Size: 1210; ComponentLink1Description: Datasheet; ComponentLink1URL: https://search.murata.co.jp/Ceramy/image/img/A01X/G101/ENG/GRM32ER61C476KE15-01.pdf
C69 = CAP-3N-0001: 3000 pF ±5% 50V Ceramic Capacitor C0G, NP0 0603 (1608 Metric); Device Class: Ceramic; Size: 1210; ComponentLink1Description: Datasheet; ComponentLink1URL: https://mm.digikey.com/Volume0/opasdata/d220001/medias/docus/41/CL32B106KBJNNNE_Spec.pdf
D17 D19 = LED-0001: LED YELLOW CLEAR 0603 SMD; ComponentLink1Description: Datasheet; ComponentLink1URL: https://www.americanbrightled.com/pdffiles/led-components/smt/BL-HKC36G-AV-TRB.pdf
D18 D20 = DIO-SCHOTTKY-0001: DIODE SCHOTTKY 60V 7A POWERDI5; ComponentLink1Description: Datasheet; ComponentLink1URL: https://www.diodes.com/assets/Datasheets/PDS760.pdf
I1 = IC_LDO_3V3_0001: IC REG LIN 3.3V 800MA SOT223-4; ComponentLink1Description: New link; ComponentLink1URL: https://www.ti.com/lit/ds/symlink/lm1117.pdf?HQS=dis-dk-null-digikeymode-dsf-pf-null-wwe&ts=1721700739746
I2 = IC_LDO_5V_0001: IC REG LINEAR 5V 800MA SOT223-4; ComponentLink1Description: Datasheet; ComponentLink1URL: https://www.ti.com/lit/ds/symlink/lm1117.pdf?HQS=dis-dk-null-digikeymode-dsf-pf-null-wwe&ts=1721700739746
L1 = IND-15U-0002-NoJLC: SMD MOLDING POWER CHOKE; ComponentLink1Description: Datasheet; ComponentLink1URL: https://www.digikey.com/en/products/detail/codaca/CSAD1010-150M/16633512?s=N4IgjCBcoBwAxVAYygMwIYBsDOBTANCAPZQDaIALHAExwDMEAuoQA4AuUIAymwE4CWAOwDmIAL6Ew1MAE5EIFJAw4CxMiGoy6AdmoUQhajGqa6BjTDp6zhywFY4c23UtOLFbVXPVtYK3e9dODsbdwA2OxgQZhB2Th4BEXFJTQhoBTQsPEISSHITS0do1g5Ibj4hUQkNOBhteTiygFVBfjYAeVQAWVx0bABXXlxzfs4AVoAJcwBbIU4wAMJp9AAPeYDq2hgo9MaQFrbOnr7B4cJRsoBBGbmyuwA6DcIAWmp5RT5%2B1VzyAMYxAFAA
L2 = IND-10U-0002: IHLP-2525CZ-11 10 20% ER E3; Manufacturer_Name: Vishay; Copyright: Copyright (C) 2025 Ultra Librarian. All rights reserved.; Manufacturer_Part_Number: IHLP2525CZER100M11; Datasheet: https://www.vishay.com/doc?34190; ComponentLink1Description: Datasheet; ComponentLink1URL: https://www.vishay.com/docs/34190/ihlp-2525cz-11.pdf
Q7 Q8 = NMOS-200MA-0001: MOSFET N-CH 60V 200MA SOT23; ComponentLink1Description: Datasheet; ComponentLink1URL: https://toshiba.semicon-storage.com/info/T2N7002AK_datasheet_en_20150401.pdf?did=29712&prodName=T2N7002AK
R21 R29 = RES-240-0001: 240R 0.063W 1% 0402 (1005 Metric)  SMD; Tolerance: 1%; Size: 0402; ComponentLink1Description: Datasheet; ComponentLink1URL: https://www.yageo.com/upload/media/product/products/datasheet/rchip/PYu-RC_Group_51_RoHS_L_12.pdf
R22 R30 = RES-1k-0001: RES 1K OHM 1% 1/16W 0402; Tolerance: 1%; Size: 0402; ComponentLink1Description: Datasheet; ComponentLink1URL: https://www.yageo.com/upload/media/product/products/datasheet/rchip/PYu-RC_Group_51_RoHS_L_12.pdf
R23 R31 = RES-2.15M-0001: RES SMD 2.15M OHM 1% 1/10W 0603; Tolerance: 1%; Size: 0603; ComponentLink1Description: Datasheet; ComponentLink1URL: https://www.yageo.com/upload/media/product/products/datasheet/rchip/PYu-RC_Group_51_RoHS_L_12.pdf
R24 = RES-147k-0001: RES 147K OHM 1% 1/16W 0402; Tolerance: 1%; Size: 0402; ComponentLink1Description: Datasheet; ComponentLink1URL: https://www.yageo.com/upload/media/product/products/datasheet/rchip/PYu-RC_Group_51_RoHS_L_12.pdf
R25 R34 = RES-178k-0001: 62.5mW Thick Film Resistors 50V ±100ppm/℃ ±1% 178kΩ 0402 Chip Resistor - Surface Mount ROHS; Tolerance: 1%; Size: 0402; ComponentLink1Description: Datasheet; ComponentLink1URL: https://www.lcsc.com/datasheet/lcsc_datasheet_2304140030_RALEC-RTT021783FTH_C102842.pdf
R26 R33 = RES-100k-0001: RES SMD 100K OHM 1% 1/10W 0603; Tolerance: 1%; Size: 0603; ComponentLink1Description: Datasheet; ComponentLink1URL: https://www.yageo.com/upload/media/product/products/datasheet/rchip/PYu-RC_Group_51_RoHS_L_12.pdf
R27 = RES-59k-0001: RES 59K OHM 1% 1/16W 0402; Tolerance: 1%; Size: 0402; ComponentLink1Description: Datasheet; ComponentLink1URL: https://www.digikey.com/en/products/detail/yageo/RC0402FR-0759KL/2827634?s=N4IgTCBcDaIEoGEAMAWJYBicC0SDsArAJwDSAMiALoC%2BQA
R28 = RES-10.5k-0001: RES 10.5K OHM 1% 1/16W 0402; Tolerance: 1%; Size: 0402; ComponentLink1Description: Datasheet; ComponentLink1URL: https://www.yageo.com/upload/media/product/products/datasheet/rchip/PYu-RC_Group_51_RoHS_L_12.pdf
R32 = RES-80.6k-0001: 80.6 kOhms ±1% 0.063W, 1/16W Chip Resistor 0402 (1005 Metric) Moisture Resistant Thick Film; Tolerance: 1%; Size: 0402; ComponentLink1Description: Datasheet; ComponentLink1URL: https://www.yageo.com/upload/media/product/products/datasheet/rchip/PYu-RC_Group_51_RoHS_L_12.pdf
R35 = RES-36.5k-0001: 36.5 kOhms ±1% 0.063W, 1/16W Chip Resistor 0402 (1005 Metric) Moisture Resistant Thick Film; Parameter 1: *
R36 = RES-10.4k-0001: 10.4 kOhms ±0.1% 0.125W, 1/8W Chip Resistor 0805 (2012 Metric) Thin Film; Tolerance: 1%; Size: 0402; ComponentLink1Description: Datasheet; ComponentLink1URL: https://www.yageo.com/upload/media/product/products/datasheet/rchip/PYu-RC_Group_51_RoHS_L_12.pdf
U7 U8 = IC-BUCK-0001: IC REG BUCK ADJ 5A 10WSON; ComponentLink1Description: Datasheet; ComponentLink1URL: https://www.ti.com/general/docs/suppproductinfo.tsp?distId=10&gotoUrl=https%3A%2F%2Fwww.ti.com%2Flit%2Fgpn%2Ftps54561